# EAGLE design VistelV3 (EAGLE 6.4)

## Sheet 1 of 5
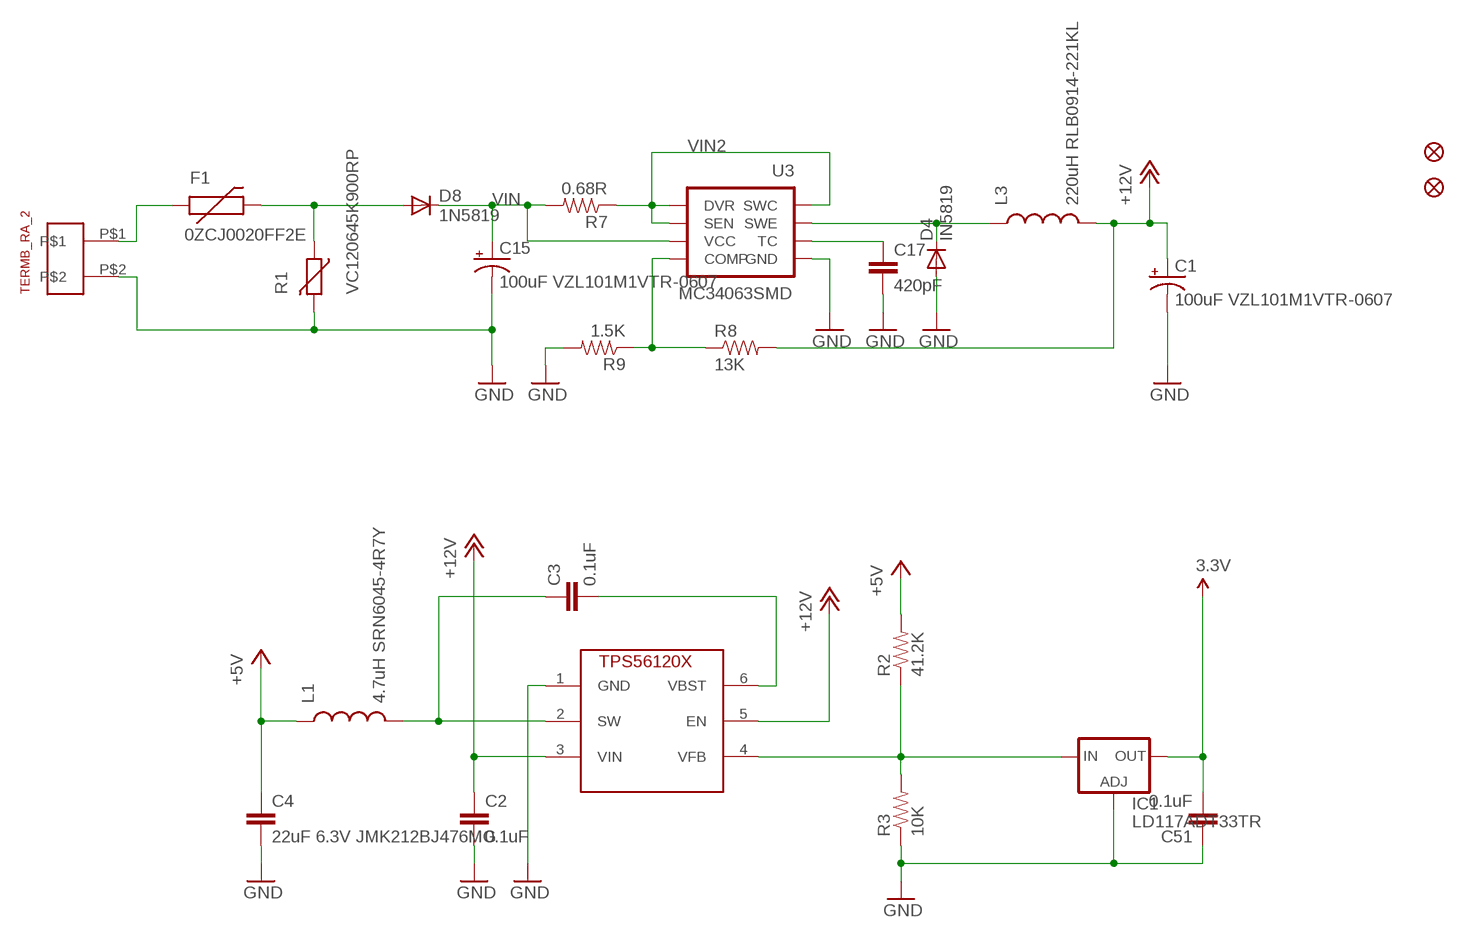
[diagram p0: schematic, sheet 1]

### Parts
C1  100uF VZL101M1VTR-0607  CAP_POLD  [PANASONIC_D]
C2  0.1uF  CAP0805  [0805]
C3  0.1uF  CAP0805  [0805]
C4  22uF 6.3V JMK212BJ476MG  CAP0805  [0805]
C15  100uF VZL101M1VTR-0607  CAP_POLD  [PANASONIC_D]
C17  420pF  CAP0805  [0805]
C51  0.1uF  CAP0805  [0805]
D4  IN5819  DIODESMA  [SMA-DIODE]
D8  1N5819  DIODESMB  [SMB-DIODE]
F1  0ZCJ0020FF2E  PTCSMD  [PTC-1206]
FID1  FIDUCIAL1.5X3  [FIDUCIAL-1.5X3]
FID2  FIDUCIAL1.5X3  [FIDUCIAL-1.5X3]
IC1  LD117ADT33TR  [DPACK]
L1  4.7uH SRN6045-4R7Y  INDUCTOR0805  [0805]
L3  220uH RLB0914-221KL  INDUCTORRADIAL5MM  [RLB914-IND]
R1  VC120645K900RP  VARISTORCN1206  [CT/CN1206]
R2  41.2K  RESISTOR0805-RES  [0805]
R3  10K  RESISTOR0805-RES  [0805]
R7  0.68R  RESISTOR0805-RES  [0805]
R8  13K  RESISTOR0805-RES  [0805]
R9  1.5K  RESISTOR0805-RES  [0805]
U3  MC34063SMD  [SO08]
U$2  1X02_TERMB_RA  [1X02_TERMB_RA]
U$18  TPS56120X  [TSOT23-6_DDC]

### Nets
3.3V: C51.2 IC1.4(OUT) ; also sheet 2,3,4,5
+5V: C4.1 L1.1 R2.2
+12V: C1.+ C2.1 L3.P$2 R8.2 U$18.3(VIN) U$18.5(EN) ; also sheet 3
GND: C1.- C2.2 C4.2 C15.- C17.2 C51.1 D4.A IC1.1(ADJ) R1.2 R3.1 R9.2 U3.4(GND) U$2.P$2 U$18.1(GND) ; also sheet 2,3,4,5
N$4: F1.1 U$2.P$1
N$5: D8.A F1.2 R1.1
N$6: C3.1 L1.2 U$18.2(SW)
N$19: C3.2 U$18.6(VBST)
N$20: IC1.3(IN) R2.1 R3.2 U$18.4(VFB)
N$22: C17.1 U3.3(TC)
N$24: D4.C L3.P$1 U3.2(SWE)
N$25: R8.1 R9.1 U3.5(COMP)
VIN: C15.+ D8.C R7.2 U3.6(VCC)
VIN2: R7.1 U3.1(SWC) U3.7(SEN) U3.8(DVR)

## Sheet 2 of 5
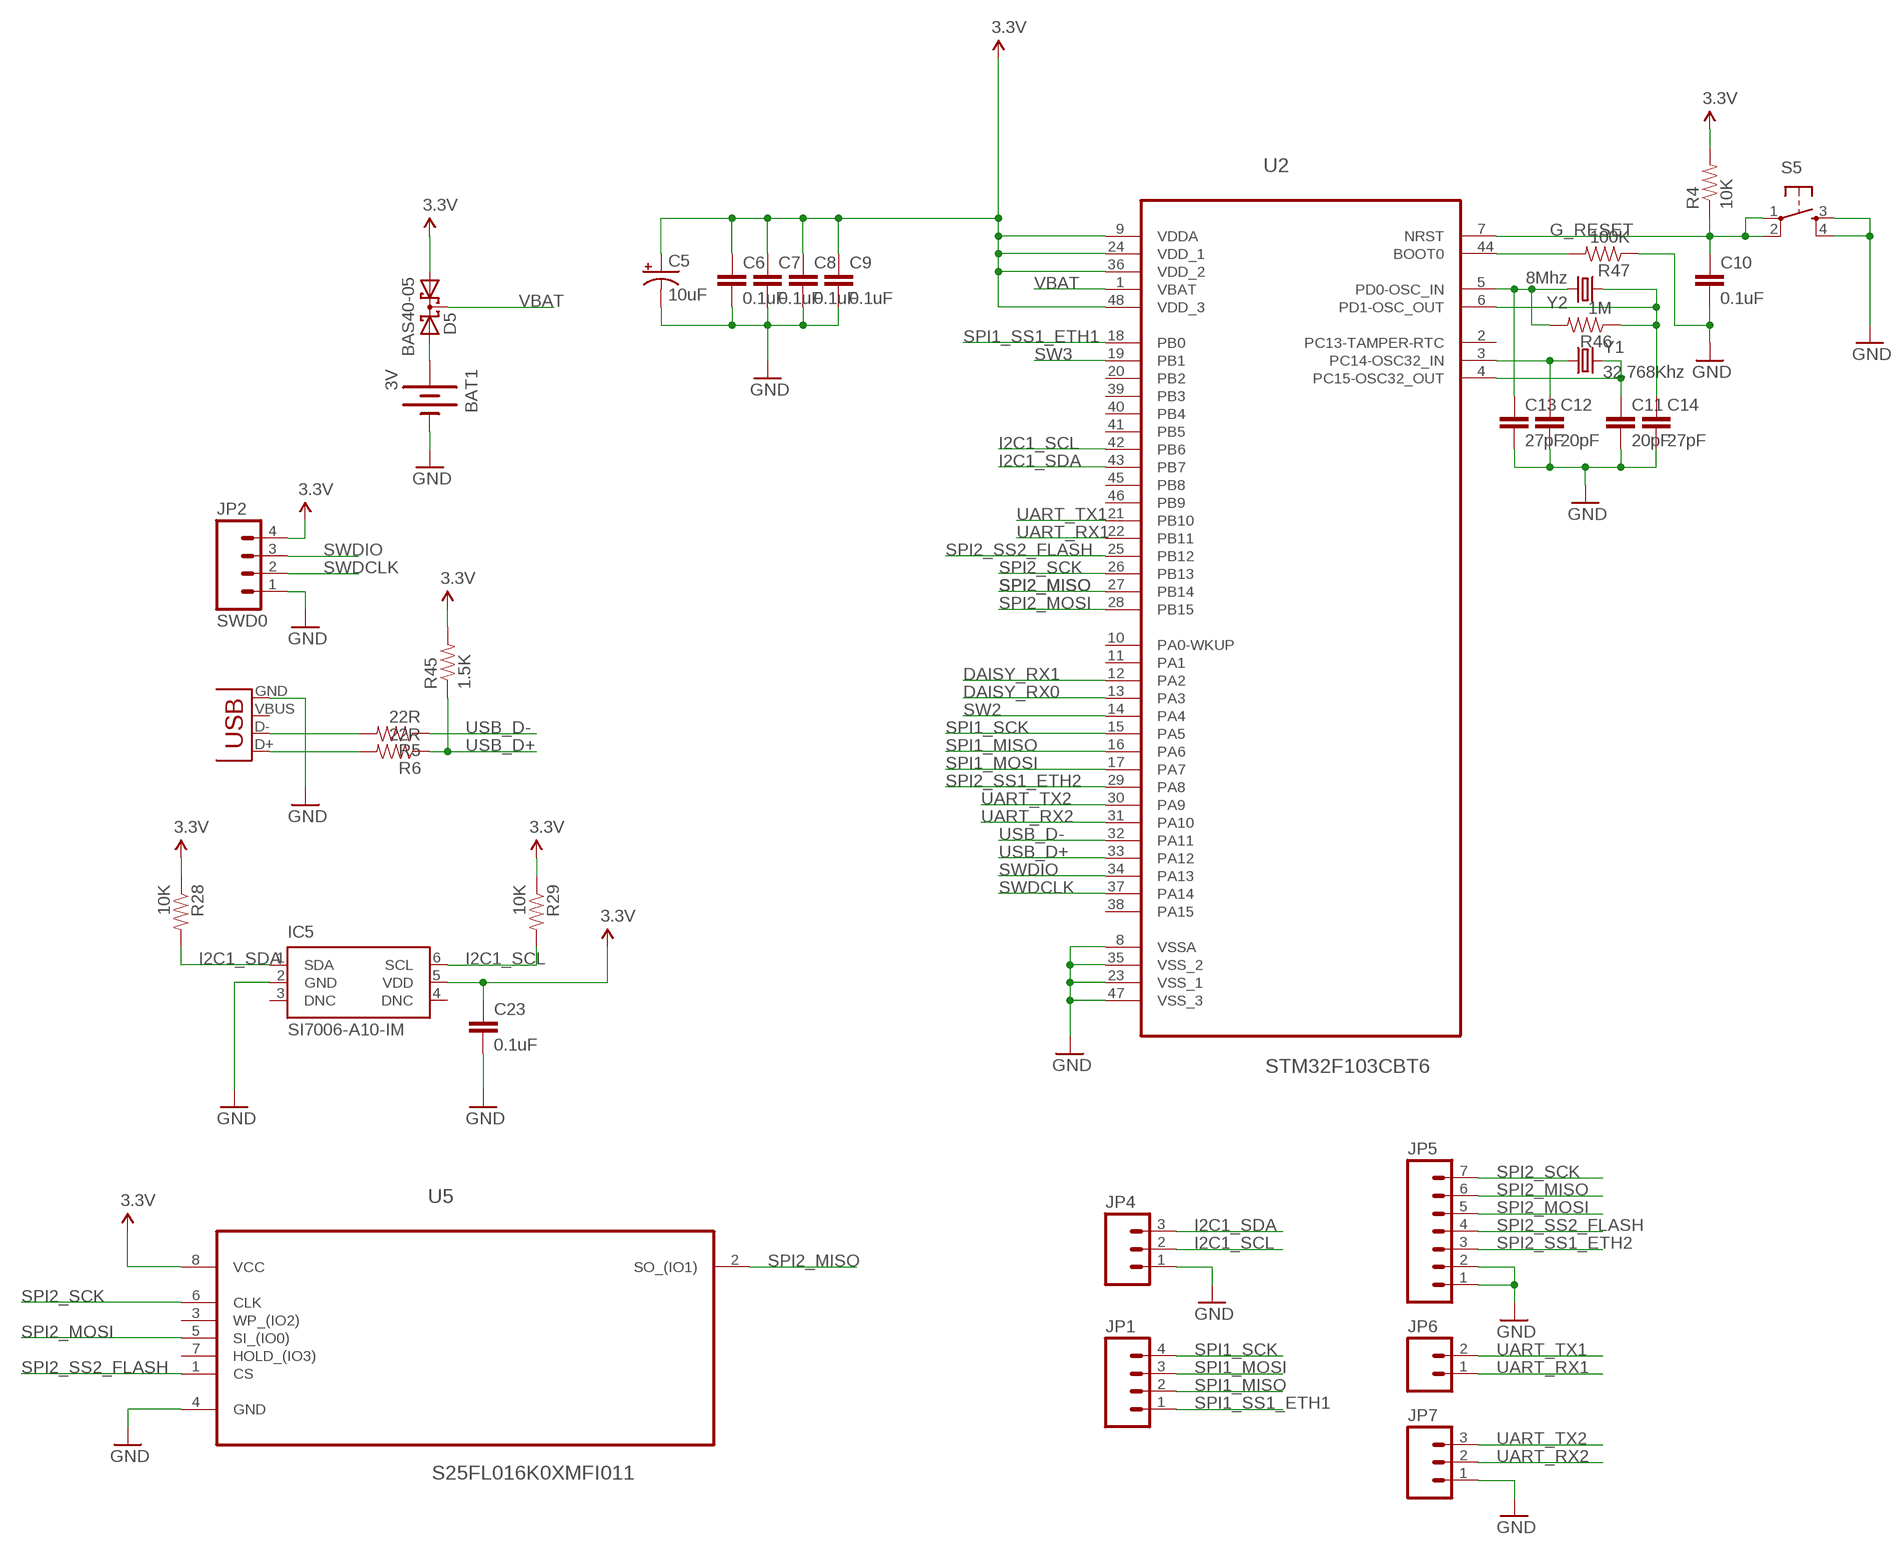
[diagram p1: schematic, sheet 2]

### Parts
BAT1  3V  BATTERY20PTH  [BATTCOM_20MM_PTH]
C5  10uF  10UF-TANT  [EIA3216]
C6  0.1uF  CAP0805  [0805]
C7  0.1uF  CAP0805  [0805]
C8  0.1uF  CAP0805  [0805]
C9  0.1uF  CAP0805  [0805]
C10  0.1uF  CAP0805  [0805]
C11  20pF  CAP0805  [0805]
C12  20pF  CAP0805  [0805]
C13  27pF  CAP0805  [0805]
C14  27pF  CAP0805  [0805]
C23  0.1uF  CAP0805  [0805]
D5  BAS40-05  [SOT23]
IC5  SI7006-A10-IM  [DFN6-3X3]
JP1  M04PTH  [1X04]
JP2  SWD0  M04PTH  [1X04]
JP3  USB-B  USBPTH  [USB-B-PTH]
JP4  M03PTH  [1X03]
JP5  M07  [1X07]
JP6  M02PTH  [1X02]
JP7  M03PTH  [1X03]
R4  10K  RESISTOR0805-RES  [0805]
R5  22R  RESISTOR0805-RES  [0805]
R6  22R  RESISTOR0805-RES  [0805]
R28  10K  RESISTOR0805-RES  [0805]
R29  10K  RESISTOR0805-RES  [0805]
R45  1.5K  RESISTOR0805-RES  [0805]
R46  1M  RESISTOR0805-RES  [0805]
R47  100K  RESISTOR0805-RES  [0805]
S5  TAC_SWITCHPTH  [TACTILE-PTH]
U2  STM32F103CBT6  [QFP50P900X900X160-48N]
U5  S25FL016K0XMFI011  [SOIC127P800X215-8N]
Y1  32.768Khz  MC-306  [MC-306]
Y2  8Mhz  CRYSTALHC49US  [HC49US]

### Nets
3.3V: C5.A(+) C6.1 C7.1 C8.1 C9.1 C23.1 D5.1(A1) IC5.5(VDD) JP2.4 R4.2 R28.1 R29.1 R45.2 U2.9(VDDA) U2.24(VDD_1) U2.36(VDD_2) U2.48(VDD_3) U5.8(VCC) ; also sheet 1,3,4,5
BOOT0: R47.2 U2.44(BOOT0)
DAISY_RX0: U2.13(PA3) ; also sheet 3
DAISY_RX1: U2.12(PA2) ; also sheet 3
G_RESET: C10.1 R4.1 S5.1 S5.2 U2.7(NRST) ; also sheet 3
GND: BAT1.2(-) C5.C(-) C6.2 C7.2 C8.2 C9.2 C10.2 C11.2 C12.2 C13.2 C14.2 C23.2 IC5.2(GND) JP2.1 JP3.GND JP4.1 JP5.1 JP5.2 JP7.1 R47.1 S5.3 S5.4 U2.8(VSSA) U2.23(VSS_1) U2.35(VSS_2) U2.47(VSS_3) U5.4(GND) ; also sheet 1,3,4,5
I2C1_SCL: IC5.6(SCL) JP4.2 R29.2 U2.42(PB6)
I2C1_SDA: IC5.1(SDA) JP4.3 R28.2 U2.43(PB7)
N$3: BAT1.1(+) D5.2(A2)
N$7: C14.1 R46.1 U2.6(PD1-OSC_OUT) Y2.1
N$10: JP3.D- R5.2
N$11: JP3.D+ R6.2
N$14: C12.1 U2.3(PC14-OSC32_IN) Y1.1
N$15: C11.1 U2.4(PC15-OSC32_OUT) Y1.4
N$16: C13.1 R46.2 U2.5(PD0-OSC_IN) Y2.2
SPI1_MISO: JP1.2 U2.16(PA6) ; also sheet 4
SPI1_MOSI: JP1.3 U2.17(PA7) ; also sheet 4
SPI1_SCK: JP1.4 U2.15(PA5) ; also sheet 4
SPI1_SS1_ETH1: JP1.1 U2.18(PB0) ; also sheet 4
SPI2_MISO: JP5.6 U2.27(PB14) U5.2(SO_(IO1)) ; also sheet 4
SPI2_MOSI: JP5.5 U2.28(PB15) U5.5(SI_(IO0)) ; also sheet 4
SPI2_SCK: JP5.7 U2.26(PB13) U5.6(CLK) ; also sheet 4
SPI2_SS1_ETH2: JP5.3 U2.29(PA8) ; also sheet 4
SPI2_SS2_FLASH: JP5.4 U2.25(PB12) U5.1(CS)
SW2: U2.14(PA4) ; also sheet 3
SW3: U2.19(PB1) ; also sheet 3
SWDCLK: JP2.2 U2.37(PA14)
SWDIO: JP2.3 U2.34(PA13)
UART_RX1: JP6.1 U2.22(PB11)
UART_RX2: JP7.2 U2.31(PA10) ; also sheet 5
UART_TX1: JP6.2 U2.21(PB10)
UART_TX2: JP7.3 U2.30(PA9) ; also sheet 5
USB_D+: R6.1 R45.1 U2.33(PA12)
USB_D-: R5.1 U2.32(PA11)
VBAT: D5.3(C) U2.1(VBAT)
Unconnected: IC5.3(DNC) IC5.4(DNC) JP3.VBUS U2.2(PC13-TAMPER-RTC) U2.10(PA0-WKUP) U2.11(PA1) U2.20(PB2) U2.38(PA15) U2.39(PB3) U2.40(PB4) U2.41(PB5) U2.45(PB8) U2.46(PB9) U5.3(WP_(IO2)) U5.7(HOLD_(IO3))

## Sheet 3 of 5
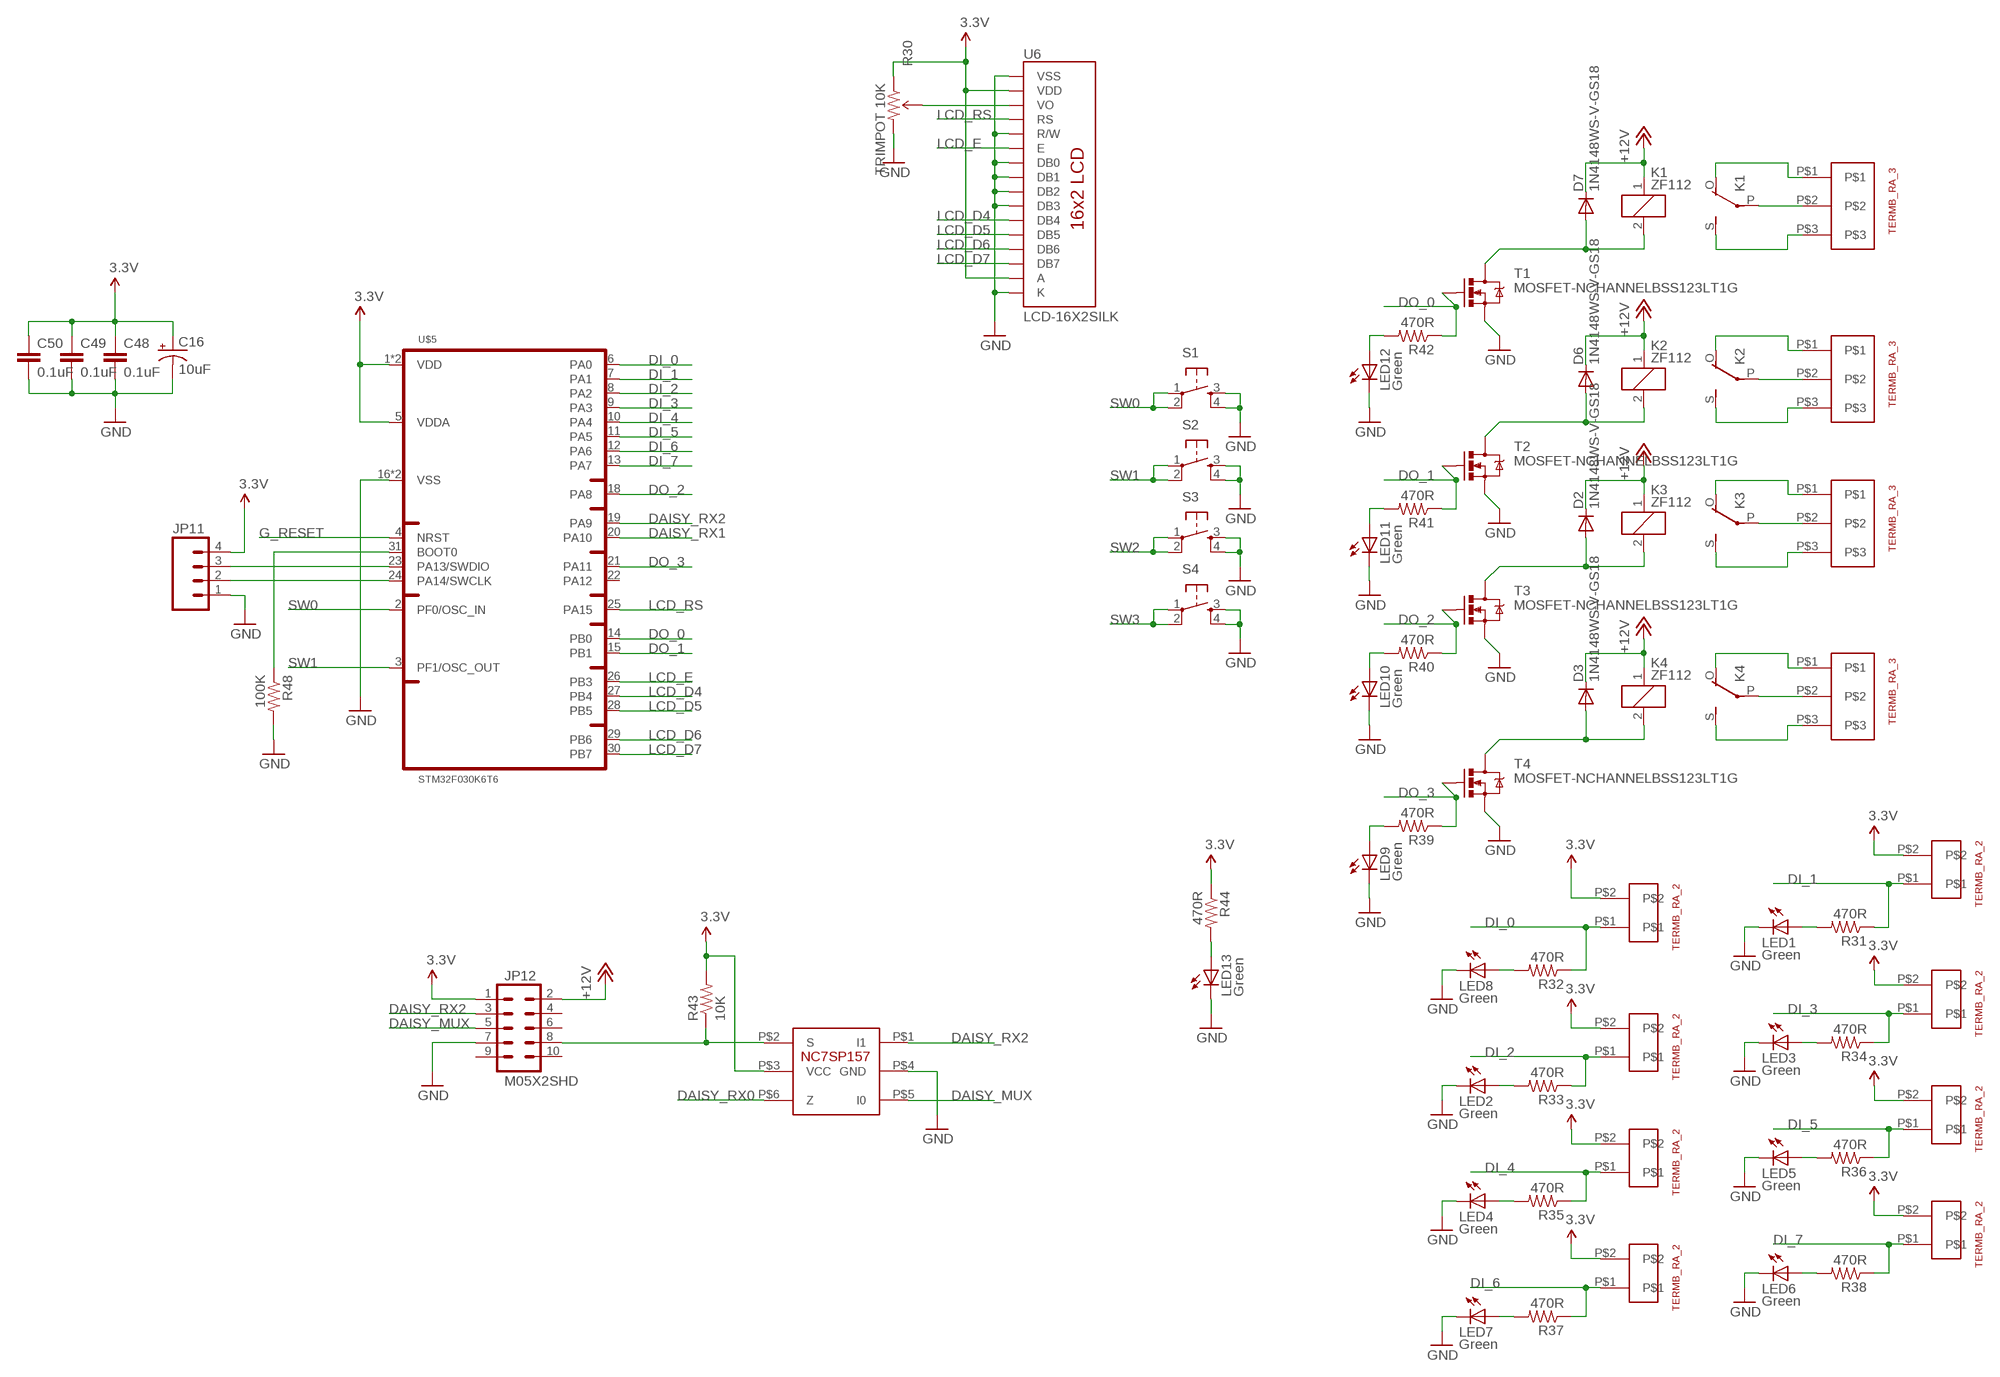
[diagram p2: schematic, sheet 3]

### Parts
C16  10uF  10UF-TANT  [EIA3216]
C48  0.1uF  CAP0805  [0805]
C49  0.1uF  CAP0805  [0805]
C50  0.1uF  CAP0805  [0805]
D2  1N4148WS-V-GS18  DIODESMA-ALT  [SMA-DIODE_ALT]
D3  1N4148WS-V-GS18  DIODESMA-ALT  [SMA-DIODE_ALT]
D6  1N4148WS-V-GS18  DIODESMA-ALT  [SMA-DIODE_ALT]
D7  1N4148WS-V-GS18  DIODESMA-ALT  [SMA-DIODE_ALT]
JP11  M04PTH  [1X04]
JP12  M05X2SHD  [2X5-SHROUDED]
K1  ZF112  [ZF112]
K2  ZF112  [ZF112]
K3  ZF112  [ZF112]
K4  ZF112  [ZF112]
LED1  Green  LED1206  [LED-1206]
LED2  Green  LED1206  [LED-1206]
LED3  Green  LED1206  [LED-1206]
LED4  Green  LED1206  [LED-1206]
LED5  Green  LED1206  [LED-1206]
LED6  Green  LED1206  [LED-1206]
LED7  Green  LED1206  [LED-1206]
LED8  Green  LED1206  [LED-1206]
LED9  Green  LED1206  [LED-1206]
LED10  Green  LED1206  [LED-1206]
LED11  Green  LED1206  [LED-1206]
LED12  Green  LED1206  [LED-1206]
LED13  Green  LED1206  [LED-1206]
R30  TRIMPOT 10K  TRIMPOTPTH  [TRIM_POT_PTH]
R31  470R  RESISTOR0805-RES  [0805]
R32  470R  RESISTOR0805-RES  [0805]
R33  470R  RESISTOR0805-RES  [0805]
R34  470R  RESISTOR0805-RES  [0805]
R35  470R  RESISTOR0805-RES  [0805]
R36  470R  RESISTOR0805-RES  [0805]
R37  470R  RESISTOR0805-RES  [0805]
R38  470R  RESISTOR0805-RES  [0805]
R39  470R  RESISTOR0805-RES  [0805]
R40  470R  RESISTOR0805-RES  [0805]
R41  470R  RESISTOR0805-RES  [0805]
R42  470R  RESISTOR0805-RES  [0805]
R43  10K  RESISTOR0805-RES  [0805]
R44  470R  RESISTOR0805-RES  [0805]
R48  100K  RESISTOR0805-RES  [0805]
S1  TAC_SWITCHPTH  [TACTILE-PTH]
S2  TAC_SWITCHPTH  [TACTILE-PTH]
S3  TAC_SWITCHPTH  [TACTILE-PTH]
S4  TAC_SWITCHPTH  [TACTILE-PTH]
T1  MOSFET-NCHANNELBSS123LT1G  [SOT23]
T2  MOSFET-NCHANNELBSS123LT1G  [SOT23]
T3  MOSFET-NCHANNELBSS123LT1G  [SOT23]
T4  MOSFET-NCHANNELBSS123LT1G  [SOT23]
U6  LCD-16X2SILK  [LCD-16X2]
U$4  NC7SP157  [SC70-6]
U$5  STM32F030K6T6  [LQFP32-7X7]
U$6  1X02_TERMB_RA  [1X02_TERMB_RA]
U$7  1X02_TERMB_RA  [1X02_TERMB_RA]
U$8  1X02_TERMB_RA  [1X02_TERMB_RA]
U$9  1X02_TERMB_RA  [1X02_TERMB_RA]
U$10  1X02_TERMB_RA  [1X02_TERMB_RA]
U$11  1X02_TERMB_RA  [1X02_TERMB_RA]
U$12  1X02_TERMB_RA  [1X02_TERMB_RA]
U$13  1X02_TERMB_RA  [1X02_TERMB_RA]
U$14  1X03_TERMB_RA  [1X03_TERMB_RA]
U$15  1X03_TERMB_RA  [1X03_TERMB_RA]
U$16  1X03_TERMB_RA  [1X03_TERMB_RA]
U$17  1X03_TERMB_RA  [1X03_TERMB_RA]

### Nets
3.3V: C16.A(+) C48.1 C49.1 C50.1 JP11.4 JP12.1 R30.1(CCW) R43.2 R44.1 U6.2(VDD) U6.15(A) U$4.P$3(VCC) U$5.1(VDD) U$5.5(VDDA) U$5.17(VDD) U$6.P$2 U$7.P$2 U$8.P$2 U$9.P$2 U$10.P$2 U$11.P$2 U$12.P$2 U$13.P$2 ; also sheet 1,2,4,5
+12V: D2.C D3.C D6.C D7.C JP12.2 K1.1 K2.1 K3.1 K4.1 ; also sheet 1
DAISY_MUX: JP12.5 U$4.P$5(I0)
DAISY_RX0: U$4.P$6(Z) ; also sheet 2
DAISY_RX1: U$5.20(PA10) ; also sheet 2
DAISY_RX2: JP12.3 U$4.P$1(I1) U$5.19(PA9)
DI_0: R32.1 U$5.6(PA0) U$6.P$1
DI_1: R31.1 U$5.7(PA1) U$7.P$1
DI_2: R33.1 U$5.8(PA2) U$13.P$1
DI_3: R34.1 U$5.9(PA3) U$8.P$1
DI_4: R35.1 U$5.10(PA4) U$12.P$1
DI_5: R36.1 U$5.11(PA5) U$9.P$1
DI_6: R37.1 U$5.12(PA6) U$11.P$1
DI_7: R38.1 U$5.13(PA7) U$10.P$1
DO_0: R42.1 T1.1(G) U$5.14(PB0)
DO_1: R41.1 T2.1(G) U$5.15(PB1)
DO_2: R40.1 T3.1(G) U$5.18(PA8)
DO_3: R39.1 T4.1(G) U$5.21(PA11)
G_RESET: U$5.4(NRST) ; also sheet 2
GND: C16.C(-) C48.2 C49.2 C50.2 JP11.1 JP12.7 LED1.C LED2.C LED3.C LED4.C LED5.C LED6.C LED7.C LED8.C LED9.C LED10.C LED11.C LED12.C LED13.C R30.3(CW) R48.2 S1.3 S1.4 S2.3 S2.4 S3.3 S3.4 S4.3 S4.4 T1.2(S) T2.2(S) T3.2(S) T4.2(S) U6.1(VSS) U6.5(R/W) U6.7(DB0) U6.8(DB1) U6.9(DB2) U6.10(DB3) U6.16(K) U$4.P$4(GND) U$5.16(VSS) U$5.32(VSS) ; also sheet 1,2,4,5
LCD_D4: U6.11(DB4) U$5.27(PB4)
LCD_D5: U6.12(DB5) U$5.28(PB5)
LCD_D6: U6.13(DB6) U$5.29(PB6)
LCD_D7: U6.14(DB7) U$5.30(PB7)
LCD_E: U6.6(E) U$5.26(PB3)
LCD_RS: U6.4(RS) U$5.25(PA15)
N$1: K1.P(2:P) U$14.P$2
N$8: LED13.A R44.2
N$9: LED7.A R37.2
N$12: R30.2(WIPER) U6.3(VO)
N$13: K4.O(2:O) U$17.P$1
N$17: R48.1 U$5.31(BOOT0)
N$21: K4.S(2:S) U$17.P$3
N$53: K3.S(2:S) U$16.P$3
N$54: K2.P(2:P) U$15.P$2
N$55: K3.O(2:O) U$16.P$1
N$56: K2.O(2:O) U$15.P$1
N$57: K2.S(2:S) U$15.P$3
N$58: K3.P(2:P) U$16.P$2
N$59: K1.O(2:O) U$14.P$1
N$60: K4.P(2:P) U$17.P$2
N$61: K1.S(2:S) U$14.P$3
N$62: D7.A K1.2 T1.3(D)
N$63: D6.A K2.2 T2.3(D)
N$64: D2.A K3.2 T3.3(D)
N$65: D3.A K4.2 T4.3(D)
N$66: LED12.A R42.2
N$67: LED11.A R41.2
N$69: JP11.3 U$5.23(PA13/SWDIO)
N$70: LED10.A R40.2
N$71: JP11.2 U$5.24(PA14/SWCLK)
N$72: LED9.A R39.2
N$73: LED1.A R31.2
N$74: LED8.A R32.2
N$75: LED2.A R33.2
N$77: JP12.8 R43.1 U$4.P$2(S)
N$78: LED3.A R34.2
N$80: LED5.A R36.2
N$82: LED4.A R35.2
N$87: LED6.A R38.2
SW0: S1.1 S1.2 U$5.2(PF0/OSC_IN)
SW1: S2.1 S2.2 U$5.3(PF1/OSC_OUT)
SW2: S3.1 S3.2 ; also sheet 2
SW3: S4.1 S4.2 ; also sheet 2
Unconnected: JP12.4 JP12.6 JP12.9 JP12.10 U$5.22(PA12)

## Sheet 4 of 5
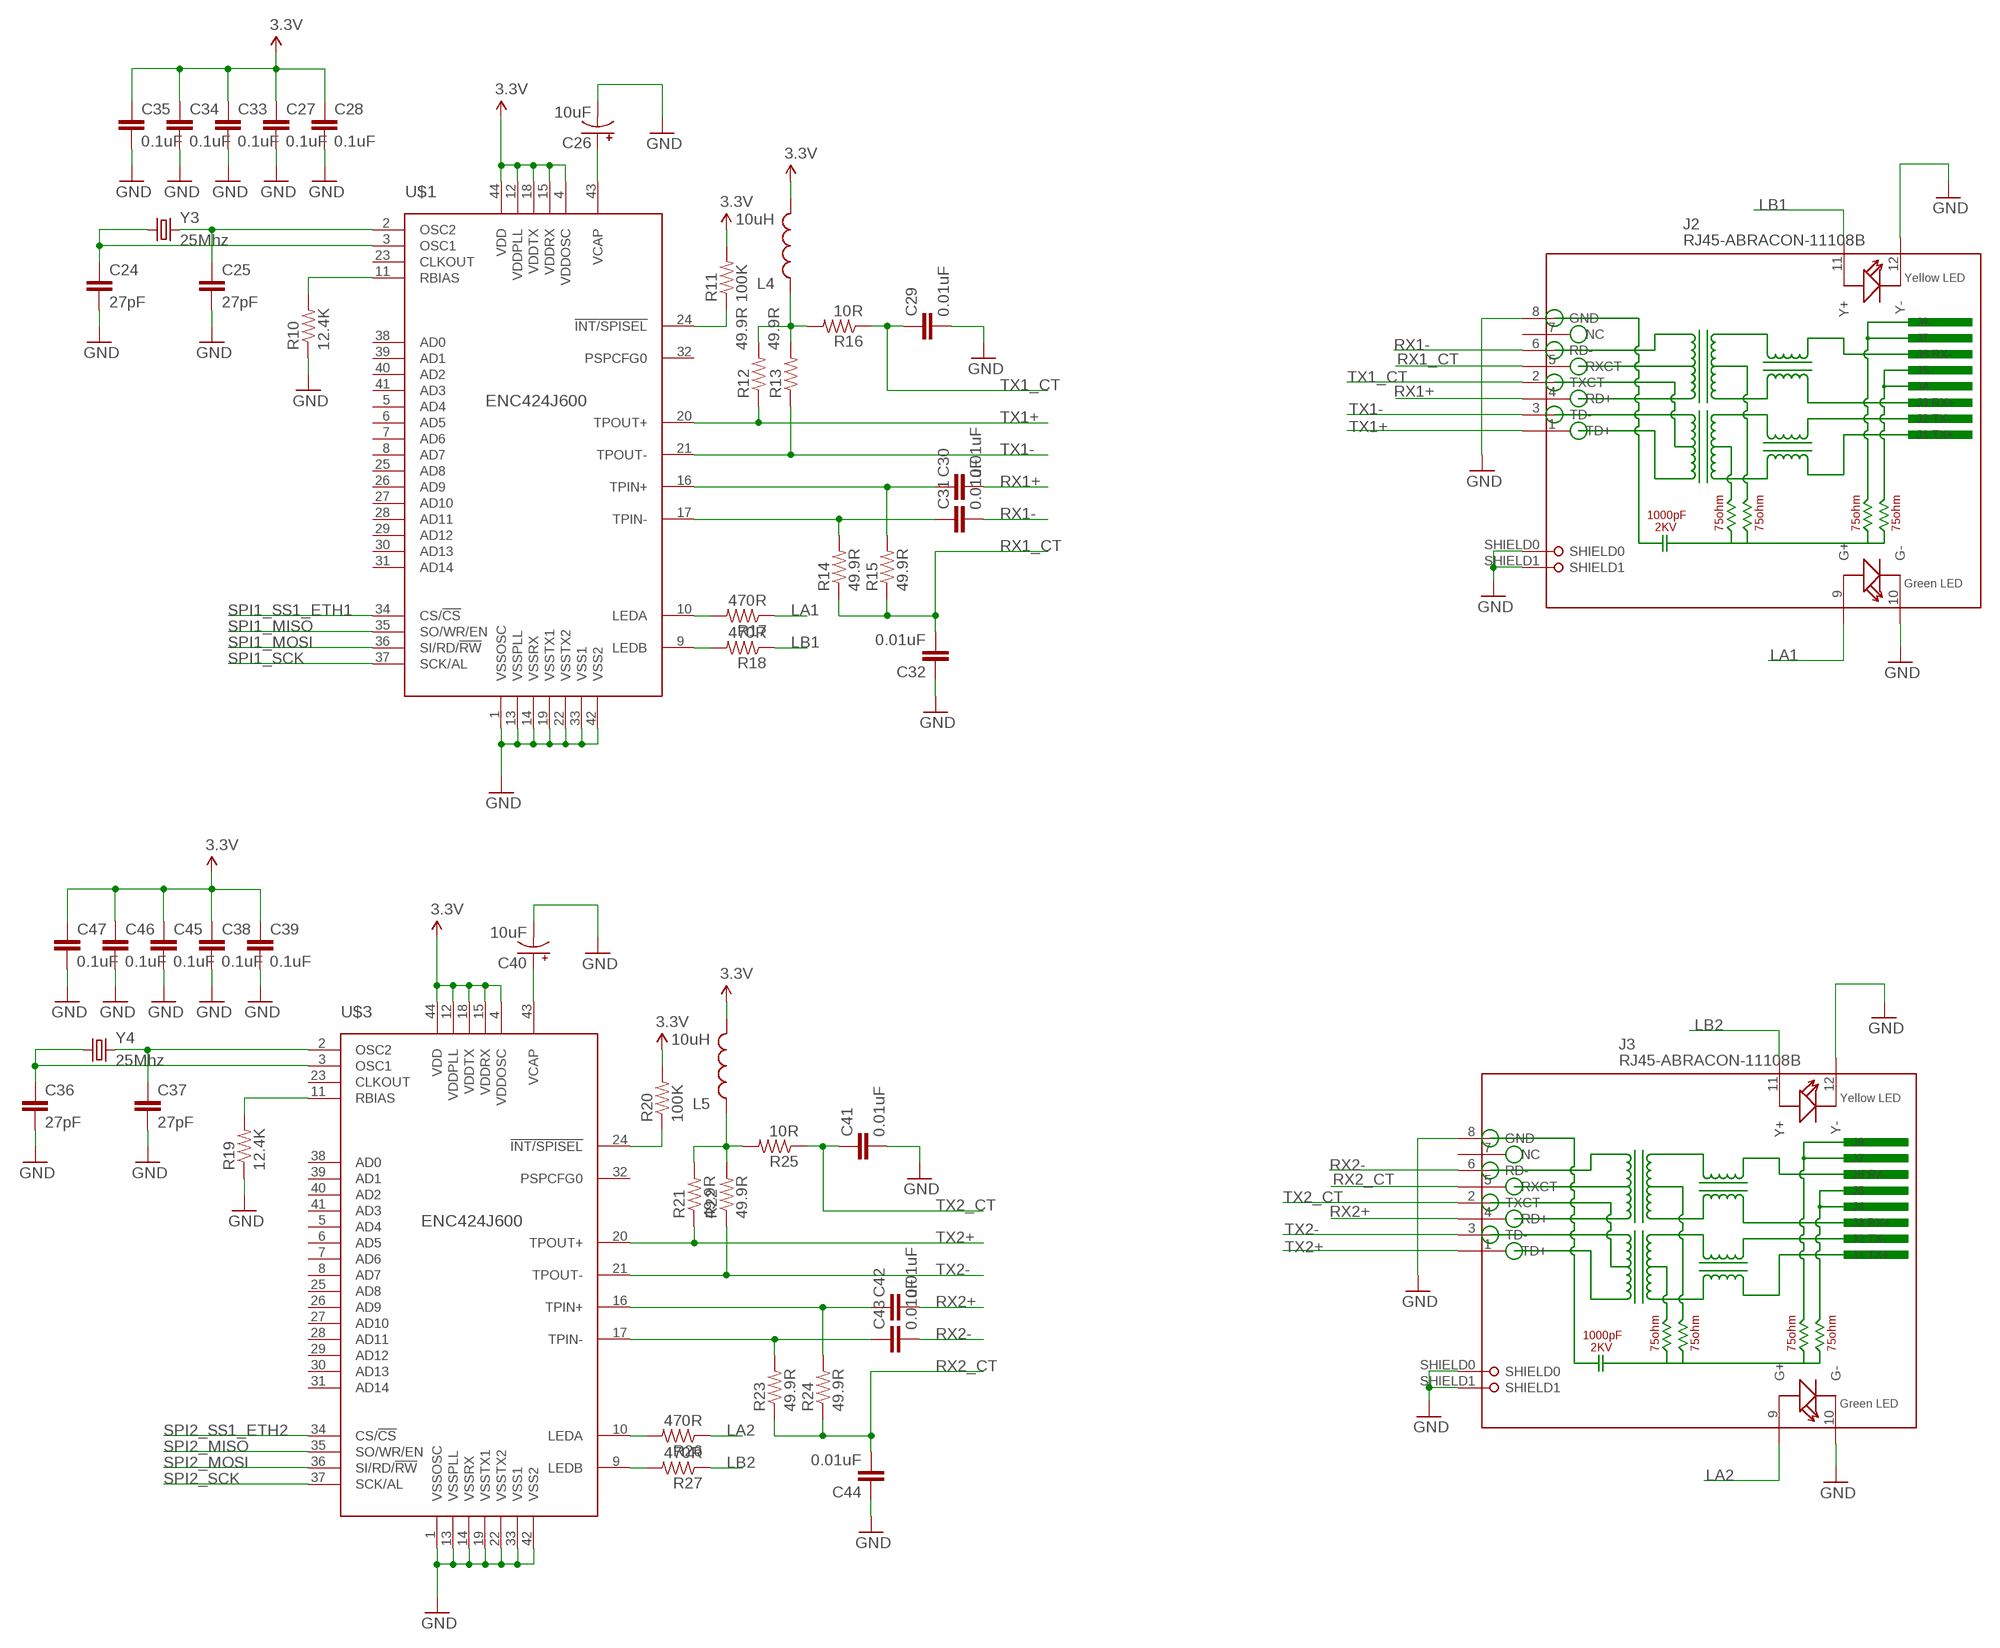
[diagram p3: schematic, sheet 4]

### Parts
C24  27pF  CAP0805  [0805]
C25  27pF  CAP0805  [0805]
C26  10uF  CAP_POL3528-KIT  [EIA3528-KIT]
C27  0.1uF  CAP0805  [0805]
C28  0.1uF  CAP0805  [0805]
C29  0.01uF  CAP0805  [0805]
C30  0.01uF  CAP0805  [0805]
C31  0.01uF  CAP0805  [0805]
C32  0.01uF  CAP0805  [0805]
C33  0.1uF  CAP0805  [0805]
C34  0.1uF  CAP0805  [0805]
C35  0.1uF  CAP0805  [0805]
C36  27pF  CAP0805  [0805]
C37  27pF  CAP0805  [0805]
C38  0.1uF  CAP0805  [0805]
C39  0.1uF  CAP0805  [0805]
C40  10uF  CAP_POL3528-KIT  [EIA3528-KIT]
C41  0.01uF  CAP0805  [0805]
C42  0.01uF  CAP0805  [0805]
C43  0.01uF  CAP0805  [0805]
C44  0.01uF  CAP0805  [0805]
C45  0.1uF  CAP0805  [0805]
C46  0.1uF  CAP0805  [0805]
C47  0.1uF  CAP0805  [0805]
J2  RJ45-ABRACON-11108B  [RJ45-ABRACON-111008B]
J3  RJ45-ABRACON-11108B  [RJ45-ABRACON-111008B]
L4  10uH  INDUCTOR0805  [0805]
L5  10uH  INDUCTOR0805  [0805]
R10  12.4K  RESISTOR0805-RES  [0805]
R11  100K  RESISTOR0805-RES  [0805]
R12  49.9R  RESISTOR0805-RES  [0805]
R13  49.9R  RESISTOR0805-RES  [0805]
R14  49.9R  RESISTOR0805-RES  [0805]
R15  49.9R  RESISTOR0805-RES  [0805]
R16  10R  RESISTOR0805-RES  [0805]
R17  470R  RESISTOR0805-RES  [0805]
R18  470R  RESISTOR0805-RES  [0805]
R19  12.4K  RESISTOR0805-RES  [0805]
R20  100K  RESISTOR0805-RES  [0805]
R21  49.9R  RESISTOR0805-RES  [0805]
R22  49.9R  RESISTOR0805-RES  [0805]
R23  49.9R  RESISTOR0805-RES  [0805]
R24  49.9R  RESISTOR0805-RES  [0805]
R25  10R  RESISTOR0805-RES  [0805]
R26  470R  RESISTOR0805-RES  [0805]
R27  470R  RESISTOR0805-RES  [0805]
U$1  ENC424J600  [TQFP-44]
U$3  ENC424J600  [TQFP-44]
Y3  25Mhz  CRYSTAL10.5X4.8  [CRYSTAL-SMD-10.5X4.8-2PIN]
Y4  25Mhz  CRYSTAL10.5X4.8  [CRYSTAL-SMD-10.5X4.8-2PIN]

### Nets
3.3V: C27.1 C28.1 C33.1 C34.1 C35.1 C38.1 C39.1 C45.1 C46.1 C47.1 L4.2 L5.2 R11.2 R20.2 U$1.4(VDDOSC) U$1.12(VDDPLL) U$1.15(VDDRX) U$1.18(VDDTX) U$1.44(VDD) U$3.4(VDDOSC) U$3.12(VDDPLL) U$3.15(VDDRX) U$3.18(VDDTX) U$3.44(VDD) ; also sheet 1,2,3,5
GND: C24.2 C25.2 C26.C(-) C27.2 C28.2 C29.2 C32.1 C33.2 C34.2 C35.2 C36.2 C37.2 C38.2 C39.2 C40.C(-) C41.2 C44.1 C45.2 C46.2 C47.2 J2.8(GND) J2.10(G-) J2.12(Y-) J2.SHIELD0 J2.SHIELD1 J3.8(GND) J3.10(G-) J3.12(Y-) J3.SHIELD0 J3.SHIELD1 R10.1 R19.1 U$1.1(VSSOSC) U$1.13(VSSPLL) U$1.14(VSSRX) U$1.19(VSSTX1) U$1.22(VSSTX2) U$1.33(VSS1) U$1.42(VSS2) U$3.1(VSSOSC) U$3.13(VSSPLL) U$3.14(VSSRX) U$3.19(VSSTX1) U$3.22(VSSTX2) U$3.33(VSS1) U$3.42(VSS2) ; also sheet 1,2,3,5
LA1: J2.9(G+) R17.1
LA2: J3.9(G+) R26.1
LB1: J2.11(Y+) R18.1
LB2: J3.11(Y+) R27.1
N$33: C24.1 U$1.3(OSC1) Y3.P$1
N$34: C40.A(+) U$3.43(VCAP)
N$35: C37.1 U$3.2(OSC2) Y4.P$2
N$36: C30.1 R15.2 U$1.16(TPIN+)
N$37: C26.A(+) U$1.43(VCAP)
N$38: C31.1 R14.2 U$1.17(TPIN-)
N$39: R19.2 U$3.11(RBIAS)
N$40: C25.1 U$1.2(OSC2) Y3.P$2
N$41: R10.2 U$1.11(RBIAS)
N$42: R11.1 U$1.24(!INT/SPISEL)
N$43: R17.2 U$1.10(LEDA)
N$44: R18.2 U$1.9(LEDB)
N$45: L4.1 R12.2 R13.2 R16.2
N$46: R20.1 U$3.24(!INT/SPISEL)
N$47: C36.1 U$3.3(OSC1) Y4.P$1
N$48: C42.1 R24.2 U$3.16(TPIN+)
N$49: C43.1 R23.2 U$3.17(TPIN-)
N$50: L5.1 R21.2 R22.2 R25.2
N$51: R26.2 U$3.10(LEDA)
N$52: R27.2 U$3.9(LEDB)
RX1+: C30.2 J2.4(RD+)
RX1-: C31.2 J2.6(RD-)
RX1_CT: C32.2 J2.5(RXCT) R14.1 R15.1
RX2+: C42.2 J3.4(RD+)
RX2-: C43.2 J3.6(RD-)
RX2_CT: C44.2 J3.5(RXCT) R23.1 R24.1
SPI1_MISO: U$1.35(SO/WR/EN) ; also sheet 2
SPI1_MOSI: U$1.36(SI/RD/!RW) ; also sheet 2
SPI1_SCK: U$1.37(SCK/AL) ; also sheet 2
SPI1_SS1_ETH1: U$1.34(CS/!CS) ; also sheet 2
SPI2_MISO: U$3.35(SO/WR/EN) ; also sheet 2
SPI2_MOSI: U$3.36(SI/RD/!RW) ; also sheet 2
SPI2_SCK: U$3.37(SCK/AL) ; also sheet 2
SPI2_SS1_ETH2: U$3.34(CS/!CS) ; also sheet 2
TX1+: J2.1(TD+) R12.1 U$1.20(TPOUT+)
TX1-: J2.3(TD-) R13.1 U$1.21(TPOUT-)
TX1_CT: C29.1 J2.2(TXCT) R16.1
TX2+: J3.1(TD+) R21.1 U$3.20(TPOUT+)
TX2-: J3.3(TD-) R22.1 U$3.21(TPOUT-)
TX2_CT: C41.1 J3.2(TXCT) R25.1
Unconnected: J2.7(NC) J3.7(NC) U$1.5(AD4) U$1.6(AD5) U$1.7(AD6) U$1.8(AD7) U$1.23(CLKOUT) U$1.25(AD8) U$1.26(AD9) U$1.27(AD10) U$1.28(AD11) U$1.29(AD12) U$1.30(AD13) U$1.31(AD14) U$1.32(PSPCFG0) U$1.38(AD0) U$1.39(AD1) U$1.40(AD2) U$1.41(AD3) U$3.5(AD4) U$3.6(AD5) U$3.7(AD6) U$3.8(AD7) U$3.23(CLKOUT) U$3.25(AD8) U$3.26(AD9) U$3.27(AD10) U$3.28(AD11) U$3.29(AD12) U$3.30(AD13) U$3.31(AD14) U$3.32(PSPCFG0) U$3.38(AD0) U$3.39(AD1) U$3.40(AD2) U$3.41(AD3)

## Sheet 5 of 5
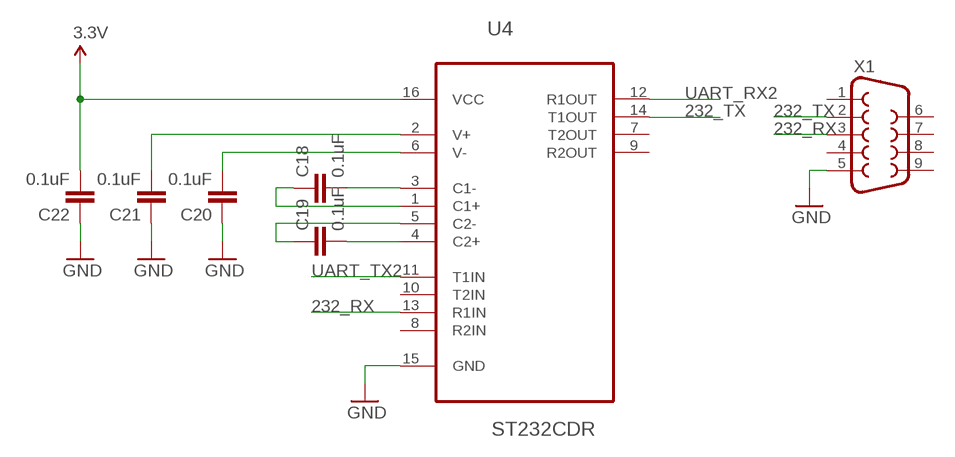
[diagram p4: schematic, sheet 5]

### Parts
C18  0.1uF  CAP0805  [0805]
C19  0.1uF  CAP0805  [0805]
C20  0.1uF  CAP0805  [0805]
C21  0.1uF  CAP0805  [0805]
C22  0.1uF  CAP0805  [0805]
U4  ST232CDR  [SOIC127P600X175-16N]
X1  DB9FEMALE  [DB9]

### Nets
3.3V: C22.2 U4.16(VCC) ; also sheet 1,2,3,4
232_RX: U4.13(R1IN) X1.3
232_TX: U4.14(T1OUT) X1.2
GND: C20.1 C21.1 C22.1 U4.15(GND) X1.5 ; also sheet 1,2,3,4
N$26: C21.2 U4.2(V+)
N$27: C20.2 U4.6(V-)
N$28: C18.2 U4.3(C1-)
N$29: C18.1 U4.1(C1+)
N$30: C19.1 U4.5(C2-)
N$31: C19.2 U4.4(C2+)
UART_RX2: U4.12(R1OUT) ; also sheet 2
UART_TX2: U4.11(T1IN) ; also sheet 2
Unconnected: U4.7(T2OUT) U4.8(R2IN) U4.9(R2OUT) U4.10(T2IN) X1.1 X1.4 X1.6 X1.7 X1.8 X1.9

## Library data of the parts
BAT1 = SparkFun-Electromechanical:BATTERY: Battery Holders Various common sizes : AA, AAA, 20mm coin cell and 12mm coin cell. 20MM_4LEGS, BATT-10373
C1 C15 C26 C40 = SparkFun-Capacitors:CAP_POL: Capacitor Polarized These are standard SMD and PTH capacitors. Normally 10uF, 47uF, and 100uF in electrolytic and tantalum varieties. Always verify the external diameter of the through hole cap, it varies with capacity, voltage, and manufacturer. The EIA devices should be standard.
C2-C4 C17-C22 C51 = SparkFun-Passives:CAP: Capacitor Standard 0603 ceramic capacitor, and 0.1" leaded capacitor.
C5 C16 = SparkFun-Capacitors:10UF-TANT: 10uF Tantalum SMT CAP-00811- 16V 10% (EIA-3216); PROD_ID: CAP-00811
C6-C14 C23-C25 C27-C39 C41-C50 = SparkFun-Capacitors:CAP: Capacitor Standard 0603 ceramic capacitor, and 0.1" leaded capacitor.
D2-D4 D6-D8 = SparkFun-DiscreteSemi:DIODE: Diode These are standard reverse protection diodes and small signal diodes. SMA package can handle up to about 1A. SOD-323 can handle about 200mA. What the SOD-323 package when ordering, there are some mfgs out there that are 5-pin packages.
D5 = diode:BAS40-05: Silicon Schottky Diodes General-purpose diode for high-speed switching
F1 = SparkFun-PowerIC:PTC: Resettable Fuse PTC Resettable Fuse. Spark Fun Electronics SKU : COM-08357
FID1 FID2 = SparkFun-Aesthetics:FIDUCIAL: Fiducial Alignment Points Various fiducial points for machine vision alignment.
IC1 = v-reg:LD117A?*: Low drop fixed and adjustable positive voltage regulators 1 A Source: http://www.st.com/stonline/products/literature/ds/7194/ld1117axx.pdf
IC5 = si70xx-10:SI7006-*: I2C Humidity and Temperature Sensor Source: http://www.silabs.com/Support%20Documents/TechnicalDocs/Si7006-A10.pdf; MF: Silicon Labs; MPN: Si7006-A10-IM; OC_FARNELL: unknown; OC_NEWARK: unknown
J2 J3 = Connector:RJ45-ABRACON-11108B
JP1 JP2 JP11 = SparkFun-Connectors:M04: Header 4 Standard 4-pin 0.1" header. Use with straight break away headers (SKU : PRT-00116), right angle break away headers (PRT-00553), swiss pins (PRT-00743), machine pins (PRT-00117), and female headers (PRT-00115). Molex polarized connector foot print use with SKU : PRT-08231 with associated crimp pins and housings. 1MM SMD Version SKU: PRT-10208
JP3 = SparkFun-Connectors:USB: USB Connectors USB-B-PTH is fully proven SKU : PRT-00139/CONN-08278 USB-miniB is fully proven SKU : PRT-00587 USB-A-PCB is untested. USB-A-H is throughly reviewed, but untested. Spark Fun Electronics SKU : PRT-00437 USB-B-SMT is throughly reviewed, but untested. Needs silkscreen touching up. USB-A-S has not been used/tested USB-MB-H has not been used/tested USB-MICROB has been used. CONN-09505; PROD_ID: CONN-08278
JP4 JP7 = SparkFun-Connectors:M03: Header 3 Standard 3-pin 0.1" header. Use with straight break away headers (SKU : PRT-00116), right angle break away headers (PRT-00553), swiss pins (PRT-00743), machine pins (PRT-00117), and female headers (PRT-00115). Molex polarized connector foot print use with SKU : PRT-08232 with associated crimp pins and housings.
JP5 = SparkFun-Connectors:M07: Header 7 Standard 7-pin 0.1" header. Use with straight break away headers (SKU : PRT-00116), right angle break away headers (PRT-00553), swiss pins (PRT-00743), machine pins (PRT-00117), and female headers (PRT-00115). NOTES ON THE VARIANTS LOCK and LOCK_LONGPADS... This footprint was designed to help hold the alignment of a through-hole component (i.e. 7-pin header) while soldering it into place. You may notice that each hole has been shifted either up or down by 0.005 of an inch from it's more standard position (which is usually a perfectly straight line). This slight alteration caused the pins (the squares in the middle) to touch the edges of the holes. Because they are alternating, it causes a "brace" to hold the header in place. 0.005 has proven to be the perfect amount of "off-center" position when using our standard breakaway headers. Although looks a little odd when you look at the bare footprint, once you have a header in there, the alteration is very hard to notice. Also, if you push a header all the way into place, it is covered up entirely on the bottom side. This idea of altering the position of holes to aid alignment will be further integrated into the Sparkfun Library for other footprints. It can help hold any component with 3 or more connection pins.
JP6 = SparkFun-Connectors:M02: Header 2 Standard 2-pin 0.1" header. Use with straight break away headers (SKU : PRT-00116), right angle break away headers (PRT-00553), swiss pins (PRT-00743), machine pins (PRT-00117), and female headers (PRT-00115). Molex polarized connector foot print use with SKU : PRT-08233 with associated crimp pins and housings.
JP12 = SparkFun-Connectors:M05X2: Header 5x2 Standard 10-pin dual row 0.1" header. Commonly used with AVR-ISP. Use with Spark Fun Electronics SKU: PRT-00778
K1-K4 = relay:ZF112: RELAY 1 x switch; OC_FARNELL: unknown; OC_NEWARK: unknown
L1 L3-L5 = SparkFun-Passives:INDUCTOR: Inductors Basic Inductor/Choke - 0603 and 1206. Footprints are not proven and vary greatly between part numbers.
LED1-LED13 = SparkFun-LED:LED: LEDs Standard schematic elements and footprints for 5mm, 3mm, 1206, and 0603 sized LEDs. 5mm - Spark Fun Electronics SKU : COM-00529 (and others)
R1 = varistor:VARISTOR: VARISTOR
R2 R3 R7-R9 R31-R44 R48 = SparkFun-Passives:RESISTOR: Resistor Basic schematic elements and footprints for 0603, 1206, and PTH resistors.
R4-R6 R10-R29 R45-R47 = SparkFun-Resistors:RESISTOR: Resistor Basic schematic elements and footprints for 0603, 1206, and PTH resistors.
R30 = SparkFun-Electromechanical:TRIMPOT: Various small potentiometers for "set-and-forget" applications
S1-S5 = SparkFun-Electromechanical:TAC_SWITCH: Momentary Switch Button commonly used for reset or general input. Spark Fun Electronics SKU : COM-00097 SMT- SWCH-08247
T1-T4 = SparkFun-DiscreteSemi:MOSFET-NCHANNEL: Common NMOSFET Parts MFG P/N Store ID Prod ID FDD8780 TRANS-09984 SI7820DN TRANS-11055 FDS6630A IC-08089 2N7002PW TRANS-11151 FQP30N06L COM-10213 TRANS-10060 BSS123LT1G TRANS-08345 BSS138 TRANS-00830 BS170 2N7000; PROD_ID: TRANS-08345
U2 = ST Microelctronics_By_element14_Batch_1:STM32F103CBT6: Medium-density performance line ARM-based 32-bit MCU; MPN: STM32F103CBT6; OC_FARNELL: 1606327; OC_NEWARK: 11N8296; PACKAGE: QFP-48; SUPPLIER: STMICROELECTRONICS
U3 = SparkFun-PowerIC:MC34063: Jellybean switching supply controller
U4 = ST Microelctronics_By_element14_Batch_1:ST232CDR: 5 V powered multi-channel RS-232 drivers and receivers; MPN: ST232CDR; OC_FARNELL: 1564303; OC_NEWARK: 89K0993; PACKAGE: SOIC-16; SUPPLIER: STMICROELECTRONICS
U5 = Spansion_By_element14_Batch_1:S25FL016K0XMFI011: 16-Mbit CMOS 3.0 Volt Flash Memory; MPN: S25FL016K0XMFI011; OC_FARNELL: 1861628; OC_NEWARK: 27T2971; PACKAGE: SOIC-8; SUPPLIER: SPANSION
U6 = SparkFun-Displays:LCD-16X2: Standard text-only 16x2 parallel input LCD
U$1 U$3 = microchip-encx24j600:ENC424J600: MICROCHIP ENC424J600 Stand-Alone 10/100 Ethernet Controller with SPI or Parallel Interface
U$2 U$6-U$13 = SparkFun-Connectors:1X02_TERMB_RA
U$4 = nxp_60:NC7SP157
U$5 = STM32F030K6T6:STM32F030K6T6
U$14-U$17 = SparkFun-Connectors:1X03_TERMB_RA
U$18 = VistelV3:TPS56120X
X1 = SparkFun-Connectors:DB9: DB9 Connector Standard DB9 (D-Sub 9) serial connector. Can be used for CAN bus as well as RS485 and RS232. Footprint production proven. Spark Fun Electronics SKU : PRT-00429
Y1 = crystal:MC-306: kHz RANGE CRYSTAL UNIT SMD Source: MC-306_405_406_E07X.PDF Homepage <http://www.epsontoyocom.co.jp>; MPN: MC-306 60.0KHZ 100PPM ,12.5PF; OC_FARNELL: 1278040; OC_NEWARK: 31M5576
Y2-Y4 = SparkFun-FreqCtrl:CRYSTAL: Various standard crystals. Proven footprints. Spark Fun Electronics SKU : COM-00534

## Board
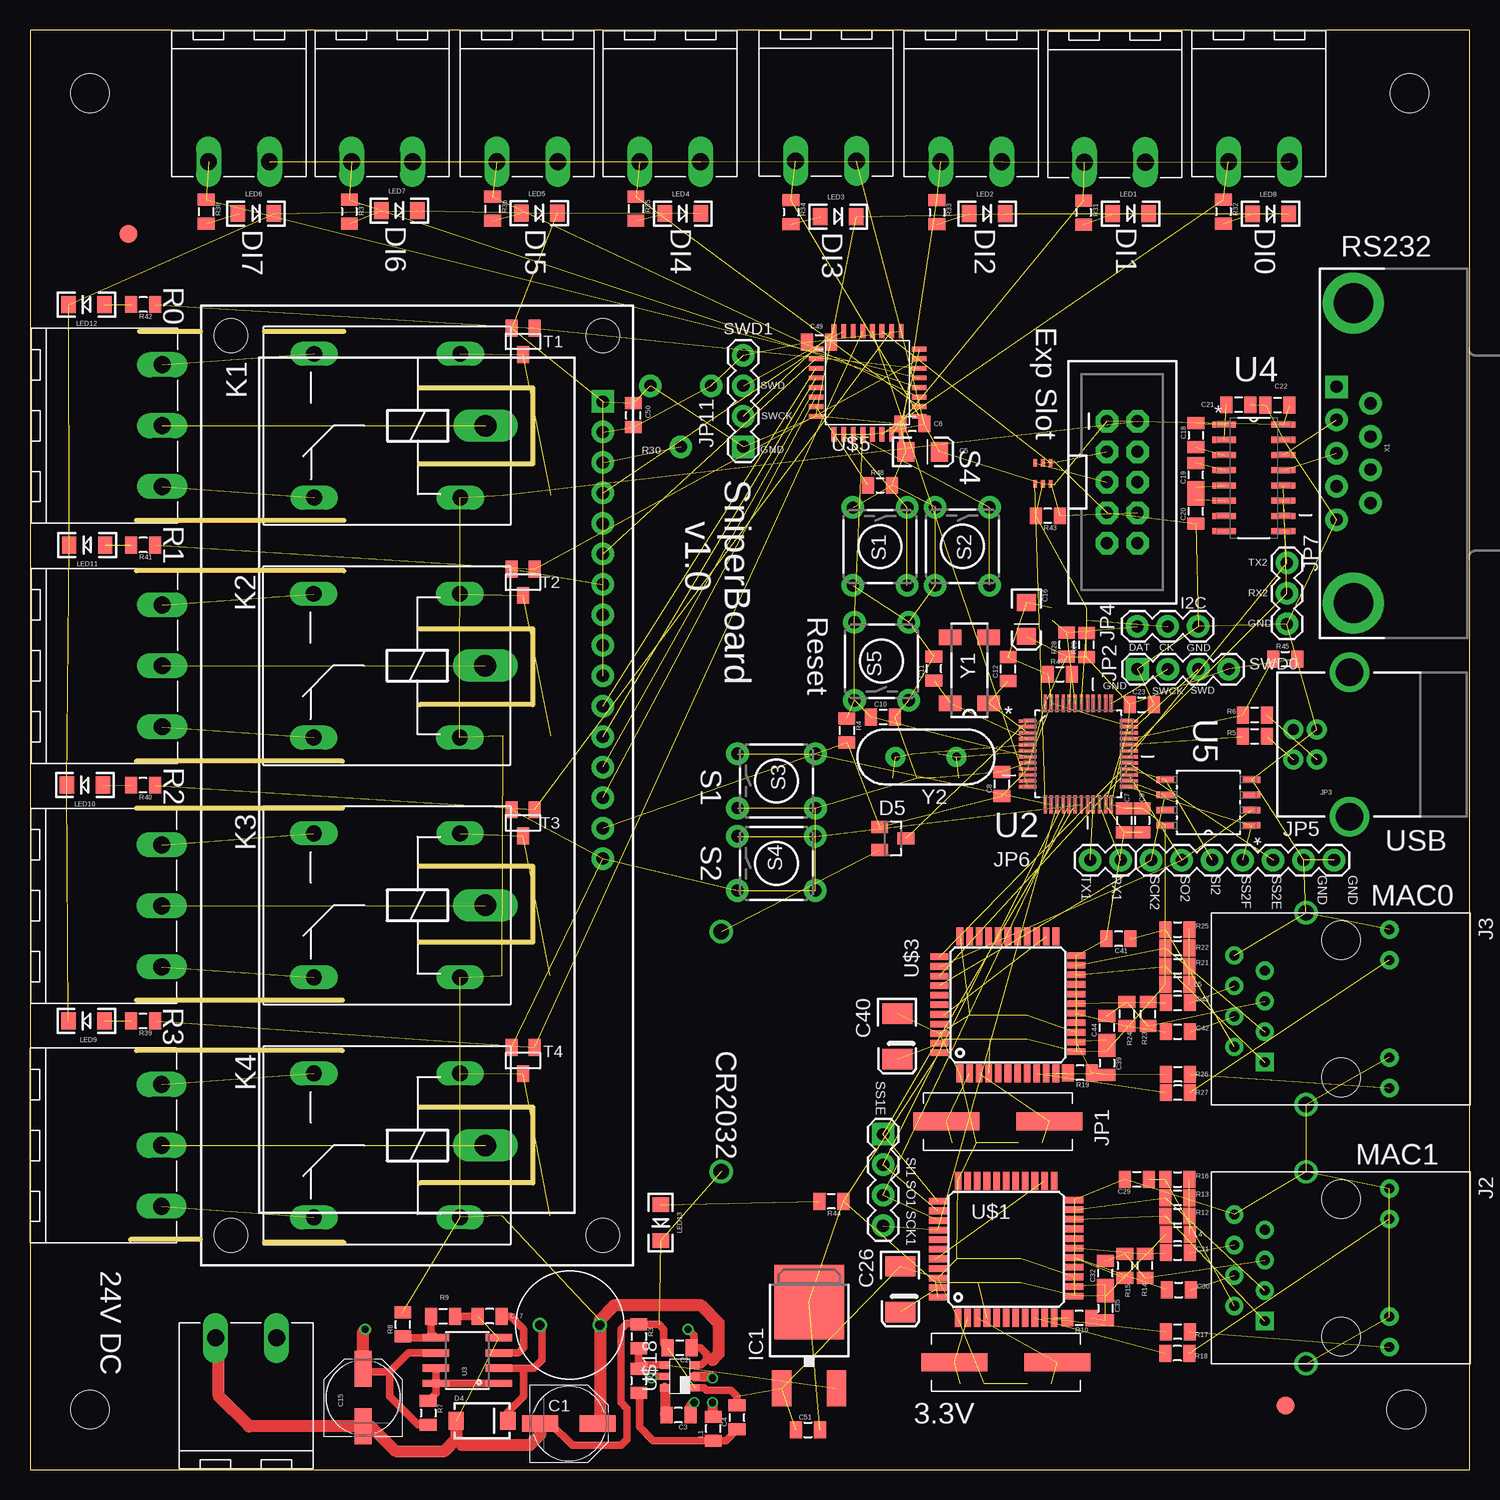
[diagram p5: board, top side]
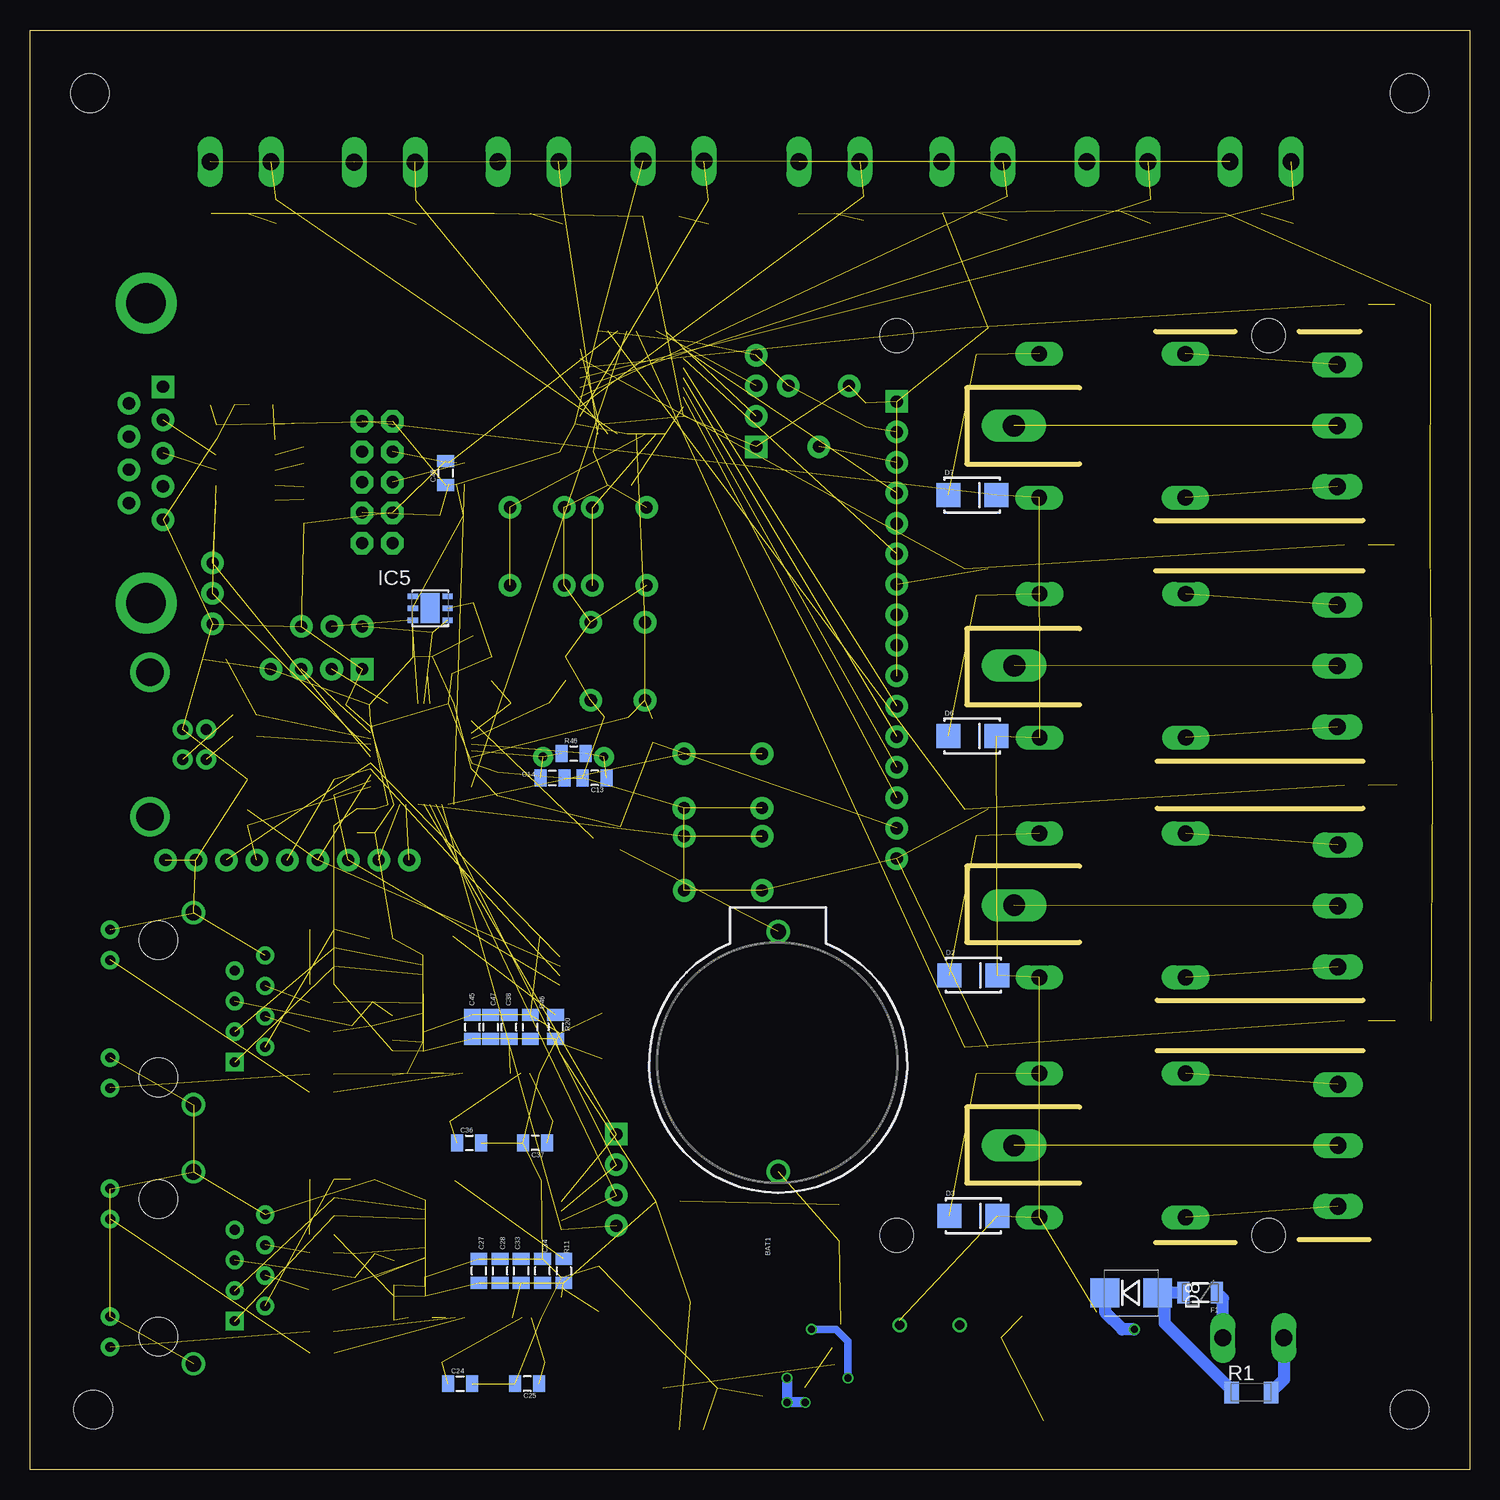
[diagram p6: board, bottom side, seen from below]

Size 120 x 120 mm. Coordinates in mm from the lower left corner, seen from the top.
Outline: 0,0 120,0 120,120 0,120 0,0
Copper layers (1*16): Top 0.035mm / dielectric 1.6mm / Bottom 0.035mm
Design rules "Elecrow_2-layer_PCB_eagle_rule *": minimum track width 8mil, minimum drill 12mil, track to track 8mil, track to pad 8mil, pad to pad 8mil, via to via 8mil, smd to smd 8mil, copper to edge 20mil, drill to drill 10mil, minimum pad ring 6mil, minimum via ring 6mil, stop-mask expansion 0mil, vias tented up to drill 100mil, thermal gap 10mil
Holes 3.2 mm at 5,114.73 114.99,114.73 114.73,5 5,5
Milling: 22 lines

### Footprints (pad centres in the part's own frame; a part is rotated, then mirrored left to right if it is on the bottom)
BATTCOM_20MM_PTH = drill 1.3: 1 20,0; 2 0,0
PANASONIC_D = smd 3 x 1.4: + 2.4,0; - -2.4,0
0805 = smd 1 x 1.4: 1 -1,0; 2 1,0
EIA3216 = smd 1.4 x 1.6: A 1.4,0; C -1.4,0
EIA3528-KIT = smd 1.7 x 2.5: A 1.9,0; C -1.9,0
SMA-DIODE_ALT = smd 2 x 2: A -2,0; C 2,0
SMA-DIODE = smd 1.27 x 1.47: A -2.15,0; C 2.15,0
SOT23 = smd 1 x 1.4: 1 -0.95,-1.1; 2 0.95,-1.1; 3 0,1.1
SMB-DIODE = smd 2.4 x 2.4: A 2.2,0; C -2.2,0
PTC-1206 = smd 1 x 1.8: 1 -1.4,0; 2 1.4,0
FIDUCIAL-1.5X3 = smd 1.5 x 1.5: 1 0,0
DPACK = smd 1.6 x 3: 1 -2.28,-4.8; 3 2.28,-4.8 | smd 5.8 x 6.2: 4 0,2.38
DFN6-3X3 = smd 0.85 x 0.45: 1 -1.45,1; 2 -1.45,0; 3 -1.45,-1; 4 1.45,-1; 5 1.45,0; 6 1.45,1 | smd 1.6 x 2.5: EXP 0,0
RJ45-ABRACON-111008B = drill 0.813 pad 1.524 square: 1 -6.35,-4.445 | drill 0.813 pad 1.524: 2 -8.89,-3.175; 3 -6.35,-1.905; 4 -8.89,-0.635; 5 -6.35,0.635; 6 -8.89,1.905; 7 -6.35,3.175; 8 -8.89,4.445; 9 4.039,-6.604; 10 4.039,-4.064; 11 4.039,4.064; 12 4.039,6.604 | drill 1.3 pad 1.778: SHIELD0 -2.921,8.001; SHIELD1 -2.921,-8.001 | hole 3.2: 0,-5.715; 0,5.715
1X04 = drill 1.016 pad 1.88 square: 1 0,0 | drill 1.016 pad 1.88: 2 2.54,0; 3 5.08,0; 4 7.62,0
USB-B-PTH = drill 0.914 pad 1.676: D+ 0,1.25; D- 1.981,1.25; GND 0,-1.25; VBUS 1.981,-1.25 | drill 2.286: S1 -2.718,-6.02; S2 -2.718,6.02
1X03 = drill 1.016 pad 1.88: 1 0,0; 2 2.54,0; 3 5.08,0
1X07 = drill 1.016 pad 1.88: 1 0,0; 2 2.54,0; 3 5.08,0; 4 7.62,0; 5 10.16,0; 6 12.7,0; 7 15.24,0
1X02 = drill 1.016 pad 1.88: 1 0,0; 2 2.54,0
2X5-SHROUDED = drill 1.016 pad 1.88 octagon: 1 -1.27,5.08; 2 1.27,5.08; 3 -1.27,2.54; 4 1.27,2.54; 5 -1.27,0; 6 1.27,0; 7 -1.27,-2.54; 8 1.27,-2.54; 9 -1.27,-5.08; 10 1.27,-5.08
ZF112 = drill 1.321 long: 1 -6.096,5.994; 2 -6.096,-5.994; O 6.096,5.994; S 6.096,-5.994 | drill 1.803 long: P -8.204,0
RLB914-IND = drill 0.8: P$1 -2.5,0; P$2 2.5,0
LED-1206 = smd 1.2 x 1.4: A -1.5,0; C 1.5,0
CT/CN1206 = smd 1.2 x 1.8: 1 -1.65,0; 2 1.65,0
TRIM_POT_PTH = drill 1 pad 1.88: 1 -2.54,-2.54; 2 0,2.54; 3 2.54,-2.54
TACTILE-PTH = drill 1.016 pad 1.88: 1 -3.251,2.261; 2 3.251,2.261; 3 -3.251,-2.261; 4 3.251,-2.261
QFP50P900X900X160-48N = smd 1.473 x 0.279: 1 -4.216,2.743; 2 -4.216,2.261; 3 -4.216,1.753; 4 -4.216,1.245; 5 -4.216,0.762; 6 -4.216,0.254; 7 -4.216,-0.254; 8 -4.216,-0.762; 9 -4.216,-1.245; 10 -4.216,-1.753; 11 -4.216,-2.261; 12 -4.216,-2.743; 25 4.216,-2.743; 26 4.216,-2.261; 27 4.216,-1.753; 28 4.216,-1.245; 29 4.216,-0.762; 30 4.216,-0.254; 31 4.216,0.254; 32 4.216,0.762; 33 4.216,1.245; 34 4.216,1.753; 35 4.216,2.261; 36 4.216,2.743 | smd 0.279 x 1.473: 13 -2.743,-4.216; 14 -2.261,-4.216; 15 -1.753,-4.216; 16 -1.245,-4.216; 17 -0.762,-4.216; 18 -0.254,-4.216; 19 0.254,-4.216; 20 0.762,-4.216; 21 1.245,-4.216; 22 1.753,-4.216; 23 2.261,-4.216; 24 2.743,-4.216; 37 2.743,4.216; 38 2.261,4.216; 39 1.753,4.216; 40 1.245,4.216; 41 0.762,4.216; 42 0.254,4.216; 43 -0.254,4.216; 44 -0.762,4.216; 45 -1.245,4.216; 46 -1.753,4.216; 47 -2.261,4.216; 48 -2.743,4.216
SO08 = smd 0.61 x 2.21: 1 -1.905,-2.616; 2 -0.635,-2.616; 3 0.635,-2.616; 4 1.905,-2.616; 5 1.905,2.616; 6 0.635,2.616; 7 -0.635,2.616; 8 -1.905,2.616
SOIC127P600X175-16N = smd 1.981 x 0.508: 1 -2.464,4.445; 2 -2.464,3.175; 3 -2.464,1.905; 4 -2.464,0.635; 5 -2.464,-0.635; 6 -2.464,-1.905; 7 -2.464,-3.175; 8 -2.464,-4.445; 9 2.464,-4.445; 10 2.464,-3.175; 11 2.464,-1.905; 12 2.464,-0.635; 13 2.464,0.635; 14 2.464,1.905; 15 2.464,3.175; 16 2.464,4.445
SOIC127P800X215-8N = smd 1.473 x 0.533: 1 -3.607,1.905; 2 -3.607,0.635; 3 -3.607,-0.635; 4 -3.607,-1.905; 5 3.607,-1.905; 6 3.607,-0.635; 7 3.607,0.635; 8 3.607,1.905
LCD-16X2 = drill 1.016 pad 1.88 square: 1 -32,15.5 | drill 1.016 pad 1.88: 2 -29.46,15.5; 3 -26.92,15.5; 4 -24.38,15.5; 5 -21.84,15.5; 6 -19.3,15.5; 7 -16.76,15.5; 8 -14.22,15.5; 9 -11.68,15.5; 10 -9.14,15.5; 11 -6.6,15.5; 12 -4.06,15.5; 13 -1.52,15.5; 14 1.02,15.5; 15 3.56,15.5; 16 6.1,15.5 | hole 2.8: -37.5,15.5; -37.5,-15.5; 37.5,15.5; 37.5,-15.5
TQFP-44 = smd 1.5 x 0.55: 1 -5.7,4; 2 -5.7,3.2; 3 -5.7,2.4; 4 -5.7,1.6; 5 -5.7,0.8; 6 -5.7,0; 7 -5.7,-0.8; 8 -5.7,-1.6; 9 -5.7,-2.4; 10 -5.7,-3.2; 11 -5.7,-4; 23 5.7,-4; 24 5.7,-3.2; 25 5.7,-2.4; 26 5.7,-1.6; 27 5.7,-0.8; 28 5.7,0; 29 5.7,0.8; 30 5.7,1.6; 31 5.7,2.4; 32 5.7,3.2; 33 5.7,4 | smd 0.55 x 1.5: 12 -3.9,-5.7; 13 -3.1,-5.7; 14 -2.3,-5.7; 15 -1.5,-5.7; 16 -0.7,-5.7; 17 0.1,-5.7; 18 0.9,-5.7; 19 1.7,-5.7; 20 2.5,-5.7; 21 3.3,-5.7; 22 4.1,-5.7; 34 4,5.7; 35 3.2,5.7; 36 2.4,5.7; 37 1.6,5.7; 38 0.8,5.7; 39 0,5.7; 40 -0.8,5.7; 41 -1.6,5.7; 42 -2.4,5.7; 43 -3.2,5.7; 44 -4,5.7
1X02_TERMB_RA = drill 1.4 long: P$1 0,2.54; P$2 0,-2.54
SC70-6 = smd 0.61 x 0.305: P$1 -0.85,0; P$2 0.9,0; P$3 0.9,-0.65; P$4 -0.85,-0.65; P$5 -0.85,-1.3; P$6 0.9,-1.3
LQFP32-7X7 = smd 1.2 x 0.4: 1 -4.3,2.8; 2 -4.3,2; 3 -4.3,1.2; 4 -4.3,0.4; 5 -4.3,-0.4; 6 -4.3,-1.2; 7 -4.3,-2; 8 -4.3,-2.8; 17 4.3,-2.8; 18 4.3,-2; 19 4.3,-1.2; 20 4.3,-0.4; 21 4.3,0.4; 22 4.3,1.2; 23 4.3,2; 24 4.3,2.8 | smd 0.4 x 1.2: 9 -2.8,-4.3; 10 -2,-4.3; 11 -1.2,-4.3; 12 -0.4,-4.3; 13 0.4,-4.3; 14 1.2,-4.3; 15 2,-4.3; 16 2.8,-4.3; 25 2.8,4.3; 26 2,4.3; 27 1.2,4.3; 28 0.4,4.3; 29 -0.4,4.3; 30 -1.2,4.3; 31 -2,4.3; 32 -2.8,4.3
1X03_TERMB_RA = drill 1.4 long: P$1 0,5.08; P$2 0,0; P$3 0,-5.08
TSOT23-6_DDC = smd 0.6 x 0.8: 1 -0.95,-1.25; 2 0,-1.25; 3 0.95,-1.25; 4 0.95,1.25; 5 0,1.25; 6 -0.95,1.25
DB9 = drill 1.016 pad 1.88 square: 1 -5.54,-1.42 | drill 1.016 pad 1.88: 2 -2.77,-1.42; 3 0,-1.42; 4 2.77,-1.42; 5 5.54,-1.42; 6 -4.15,1.42; 7 -1.38,1.42; 8 1.38,1.42; 9 4.15,1.42 | drill 3.302 pad 5.08: G1 -12.5,0; G2 12.5,0
MC-306 = smd 1.3 x 1.9: 1 -2.75,-1.6; 2 2.75,-1.6; 3 2.75,1.6; 4 -2.75,1.6
HC49US = drill 0.7 pad 1.651: 1 -2.54,0; 2 2.54,0
CRYSTAL-SMD-10.5X4.8-2PIN = smd 5.5 x 1.5: P$1 -4.3,0; P$2 4.3,0

### Placement (x,y rotation side)
BAT1  57.63,24.84 90 bottom
C1  44.93,3.83 0 top
C2  54.16,10.14 180 top
C3  54.05,4.54 180 top
C4  58.94,4.33 90 top
C5  74.42,84.84 0 top
C6  73.55,87.16 180 top
C7  91.21,54.1 270 top
C8  81.03,57.15 90 top
C9  92.71,54.1 270 top
C10  71.12,62.74 0 top
C11  75.36,66.77 90 top
C12  81.53,66.74 90 top
C13  72.93,57.65 180 bottom
C14  76.45,57.66 0 bottom
C15  27.77,5.99 90 top
C16  83.06,70.87 270 top
C17  38.32,12.78 180 top
C18  97.19,86.22 270 top
C19  97.19,82.92 90 top
C20  97.19,79.87 90 top
C21  100.74,88.76 180 top
C22  104,88.74 0 top
C23  92.67,63.77 0 top
C24  84.14,7.16 0 bottom
C25  78.55,7.16 180 bottom
C26  72.55,15.03 270 top
C27  82.59,16.56 90 bottom
C28  80.81,16.56 90 bottom
C29  92.27,24.18 180 top
C30  95.75,14.97 0 top
C31  95.67,18.08 0 top
C32  89.65,16.38 90 top
C33  79.06,16.56 90 bottom
C34  77.28,16.56 90 bottom
C35  89.65,13.43 270 top
C36  83.38,27.23 0 bottom
C37  77.89,27.23 180 bottom
C38  80.07,36.88 90 bottom
C39  89.78,33.88 270 top
C40  72.3,36.12 270 top
C41  90.74,44.24 180 top
C42  95.67,36.5 0 top
C43  95.67,38.91 0 top
C44  89.78,36.83 90 top
C45  83.12,36.88 90 bottom
C46  78.3,36.88 90 bottom
C47  81.6,36.88 90 bottom
C48  85.34,83.06 90 bottom
C49  65.79,93.98 0 top
C50  50.29,87.88 90 top
C51  64.85,3.3 0 top
D2  41.35,41.21 0 bottom
D3  41.35,21.14 0 bottom
D4  37.68,4.06 0 top
D5  71.93,52.6 270 top
D6  41.45,61.16 0 bottom
D7  41.45,81.22 0 bottom
D8  28.19,14.73 0 bottom
F1  22.44,14.74 180 bottom
FID1  104.65,5.33 0 top
FID2  8.22,103 0 top
IC1  64.95,11.58 0 top
IC5  86.64,71.8 180 bottom
J2  109.28,16.81 0 top
J3  109.28,38.4 0 top
JP1  71.12,27.94 270 top
JP2  92.31,66.72 0 top
JP3  107.28,60.44 180 top
JP4  97.38,70.28 180 top
JP5  108.71,50.8 180 top
JP6  90.93,50.8 180 top
JP7  104.78,70.48 90 top
JP11  59.47,85.26 90 top
JP12  91.05,82.31 0 top
K1  29.77,87.01 180 top
K2  29.74,67 180 top
K3  29.76,47.03 180 top
K4  29.76,27.01 180 top
L1  56.96,3.41 90 top
L3  45.01,12.03 0 top
L4  95.67,19.61 180 top
L5  95.67,40.43 180 top
LED1  91.76,104.69 0 top
LED2  79.8,104.69 0 top
LED3  67.38,104.45 0 top
LED4  54.42,104.7 0 top
LED5  42.45,104.72 0 top
LED6  18.85,104.7 0 top
LED7  30.78,104.94 0 top
LED8  103.41,104.67 0 top
LED9  4.7,37.4 180 top
LED10  4.57,57.05 180 top
LED11  4.77,77.07 180 top
LED12  4.71,97.11 180 top
LED13  52.58,20.57 270 top
R1  18.19,6.43 0 bottom
R2  50.74,7.4 270 top
R3  50.75,11.08 270 top
R4  68.09,61.61 270 top
R5  102.09,61.12 0 top
R6  102.08,62.9 0 top
R7  33.2,4.71 270 top
R8  31.08,12.09 90 top
R9  34.43,12.78 0 top
R10  87.47,12.63 180 top
R11  75.5,16.56 270 bottom
R12  95.67,21.13 0 top
R13  95.67,22.65 0 top
R14  92.95,16.99 90 top
R15  91.27,16.99 270 top
R16  95.67,24.18 0 top
R17  95.67,11.48 180 top
R18  95.64,9.7 180 top
R19  87.54,33.07 180 top
R20  76.19,36.91 270 bottom
R21  95.67,41.96 0 top
R22  95.67,43.48 0 top
R23  93.2,37.97 90 top
R24  91.43,37.97 270 top
R25  95.67,45.01 0 top
R26  95.69,32.94 180 top
R27  95.69,31.42 180 top
R28  86.42,68.76 90 top
R29  88.08,68.75 90 top
R30  54.25,87.8 180 top
R31  87.83,104.79 270 top
R32  99.49,104.85 270 top
R33  75.61,104.8 270 top
R34  63.44,104.82 270 top
R35  50.51,105.11 270 top
R36  38.56,105.09 270 top
R37  26.62,104.86 270 top
R38  14.68,104.85 270 top
R39  9.42,37.39 180 top
R40  9.42,57.04 180 top
R41  9.43,77.07 180 top
R42  9.43,97.12 180 top
R43  84.84,79.5 180 top
R44  66.8,22.35 180 top
R45  104.65,67.56 0 top
R46  74.68,59.69 0 bottom
R47  85.85,66.29 0 top
R48  70.87,82.04 0 top
S1  70.86,76.95 270 top
S2  77.72,76.96 270 top
S3  62.23,57.4 0 top
S4  62.22,50.53 0 top
S5  70.99,67.38 90 top
T1  41.1,94.04 180 top
T2  41.1,73.97 180 top
T3  41.1,53.91 180 top
T4  41.1,34.09 180 top
U2  87.39,59.66 0 top
U3  36.45,9.09 90 top
U4  102.01,82.66 0 top
U5  98.23,55.61 180 top
U6  32.25,57.03 270 top
U$1  81.37,18.36 90 top
U$2  18.01,10.97 270 top
U$3  81.52,38.73 90 top
U$4  85.09,83.06 270 top
U$5  69.83,90.6 90 top
U$6  102.45,109.03 90 top
U$7  90.43,108.98 90 top
U$8  66.36,109.08 90 top
U$9  41.45,109.03 90 top
U$10  17.42,109.03 90 top
U$11  29.35,109.03 90 top
U$12  53.37,109.03 90 top
U$13  78.46,109.03 90 top
U$14  11.02,87.02 180 top
U$15  11.02,66.99 180 top
U$16  10.98,46.99 180 top
U$17  10.96,27.02 180 top
U$18  54.17,7.76 90 top
X1  110.33,84.72 270 top
Y1  78.31,66.63 90 top
Y2  74.69,59.4 180 top
Y3  81.34,8.94 180 top
Y4  80.68,29 180 top

### Tracks (layer width: path | path; a pad name or v marks a point on that pad's centre or on a via)
3.3V  (68 unrouted)
232_RX  (1 unrouted)
232_TX  (1 unrouted)
+5V
  Top 0.61: C4.1 58.02,2.41 L1.1 51.94,2.41 50.8,3.56 50.8,6.34 R2.2
+12V  (via drill 0.6)  (10 unrouted)
  Top 0.61: 56.39,9.14 56.39,9.65 55.9,10.14 C2.1 55.37,10.34 55.37,11.18 v54.86,11.68 | U$18.3 55.96,8.71 56.13,8.89 56.39,9.14 | U$18.5 51.96,7.76 v51.82,7.62 | 56.9,9.14 56.39,9.14
  Top 1.016: C1.+ 47.51,4.01 L3.P$2 47.51,12.46 48.77,13.72 55.88,13.72 57.4,12.19 57.4,9.65 56.9,9.14
  Bottom 0.61: v51.82,7.62 51.82,10.67 52.83,11.68 v54.86,11.68
BOOT0  (1 unrouted)
DAISY_MUX  (1 unrouted)
DAISY_RX0  (1 unrouted)
DAISY_RX1  (1 unrouted)
DAISY_RX2  (2 unrouted)
DI_0  (2 unrouted)
DI_1  (2 unrouted)
DI_2  (2 unrouted)
DI_3  (2 unrouted)
DI_4  (2 unrouted)
DI_5  (2 unrouted)
DI_6  (2 unrouted)
DI_7  (2 unrouted)
DO_0  (2 unrouted)
DO_1  (2 unrouted)
DO_2  (2 unrouted)
DO_3  (2 unrouted)
G_RESET  (5 unrouted)
GND  (126 unrouted)
  Top 0.61: R9.2 C17.2 | U$18.1 56.18,6.81 56.39,6.6 58.42,6.6 58.93,6.1 58.93,5.34 C4.2 | C2.2 52.83,10.47 52.83,11.68 52.43,12.08 R3.1 50.64,12.19 49.78,12.19 49.28,11.68 49.28,5.59 49.78,5.08 49.78,2.54 49.28,2.03 45.21,2.03 43.41,3.83 C1.-
  Top 1.016: U$2.P$2 15.75,10.69 15.75,6.1 18.25,3.59 C15.- 28.41,3.59 30.48,1.52 34.54,1.52 35.53,2.51 | D4.A 35.53,2.51 | C1.- 42.53,2.9 41.66,2.03 36,2.03 35.53,2.51
  Bottom 1.016: U$2.P$2 15.47,7.5 R1.2
I2C1_SCL  (3 unrouted)
I2C1_SDA  (3 unrouted)
LA1  (1 unrouted)
LA2  (1 unrouted)
LB1  (1 unrouted)
LB2  (1 unrouted)
LCD_D4  (1 unrouted)
LCD_D5  (1 unrouted)
LCD_D6  (1 unrouted)
LCD_D7  (1 unrouted)
LCD_E  (1 unrouted)
LCD_RS  (1 unrouted)
N$1  (1 unrouted)
N$3  (1 unrouted)
N$4
  Bottom 1.016: U$2.P$1 20.55,14.25 F1.1
N$5
  Bottom 1.016: F1.2 25.4,14.74 | 25.4,14.74 D8.A | R1.1 19.84,6.63 25.4,12.19 25.4,14.74
N$6  (via drill 0.6)
  Top 0.813: U$18.2 56.75,7.76 v56.9,7.62 | v56.9,5.59 56.9,4.48 L1.2 | C3.1 55.05,5.27 v55.37,5.59
  Bottom 0.813: v56.9,7.62 v56.9,5.59 v55.37,5.59
N$7  (3 unrouted)
N$8  (1 unrouted)
N$9  (1 unrouted)
N$10  (1 unrouted)
N$11  (1 unrouted)
N$12  (1 unrouted)
N$13  (1 unrouted)
N$14  (2 unrouted)
N$15  (2 unrouted)
N$16  (3 unrouted)
N$17  (1 unrouted)
N$19
  Top 0.813: U$18.6 52.92,4.67 C3.2
N$20  (1 unrouted)
  Top 0.61: R3.2 R2.1 51.06,8.71 U$18.4
N$21  (1 unrouted)
N$22
  Top 0.61: U3.3 40.71,9.72 41.15,10.16 41.15,11.68 40.05,12.78 C17.1
N$24
  Top 0.61: U3.2 41.15,8.45 | 41.15,8.45 41.98,8.45 42.67,9.14 42.67,11.87 L3.P$1 | D4.C 39.83,4.77 41.15,6.1 41.15,8.45
N$25
  Top 0.61: R8.1 31.18,10.99 U3.5 33.43,11.4 R9.1
N$26  (1 unrouted)
N$27  (1 unrouted)
N$28  (1 unrouted)
N$29  (1 unrouted)
N$30  (1 unrouted)
N$31  (1 unrouted)
N$33  (2 unrouted)
N$34  (1 unrouted)
N$35  (2 unrouted)
N$36  (2 unrouted)
N$37  (1 unrouted)
N$38  (2 unrouted)
N$39  (1 unrouted)
N$40  (2 unrouted)
N$41  (1 unrouted)
N$42  (1 unrouted)
N$43  (1 unrouted)
N$44  (1 unrouted)
N$45  (3 unrouted)
N$46  (1 unrouted)
N$47  (2 unrouted)
N$48  (2 unrouted)
N$49  (2 unrouted)
N$50  (3 unrouted)
N$51  (1 unrouted)
N$52  (1 unrouted)
N$53  (1 unrouted)
N$54  (1 unrouted)
N$55  (1 unrouted)
N$56  (1 unrouted)
N$57  (1 unrouted)
N$58  (1 unrouted)
N$59  (1 unrouted)
N$60  (1 unrouted)
N$61  (1 unrouted)
N$62  (2 unrouted)
N$63  (2 unrouted)
N$64  (2 unrouted)
N$65  (2 unrouted)
N$66  (1 unrouted)
N$67  (1 unrouted)
N$69  (1 unrouted)
N$70  (1 unrouted)
N$71  (1 unrouted)
N$72  (1 unrouted)
N$73  (1 unrouted)
N$74  (1 unrouted)
N$75  (1 unrouted)
N$77  (2 unrouted)
N$78  (1 unrouted)
N$80  (1 unrouted)
N$82  (1 unrouted)
N$87  (1 unrouted)
RX1+  (1 unrouted)
RX1-  (1 unrouted)
RX1_CT  (3 unrouted)
RX2+  (1 unrouted)
RX2-  (1 unrouted)
RX2_CT  (3 unrouted)
SPI1_MISO  (2 unrouted)
SPI1_MOSI  (2 unrouted)
SPI1_SCK  (2 unrouted)
SPI1_SS1_ETH1  (2 unrouted)
SPI2_MISO  (3 unrouted)
SPI2_MOSI  (3 unrouted)
SPI2_SCK  (3 unrouted)
SPI2_SS1_ETH2  (2 unrouted)
SPI2_SS2_FLASH  (2 unrouted)
SW0  (2 unrouted)
SW1  (2 unrouted)
SW2  (2 unrouted)
SW3  (2 unrouted)
SWDCLK  (1 unrouted)
SWDIO  (1 unrouted)
TX1+  (2 unrouted)
TX1-  (2 unrouted)
TX1_CT  (2 unrouted)
TX2+  (2 unrouted)
TX2-  (2 unrouted)
TX2_CT  (2 unrouted)
UART_RX1  (1 unrouted)
UART_RX2  (2 unrouted)
UART_TX1  (1 unrouted)
UART_TX2  (2 unrouted)
USB_D+  (2 unrouted)
USB_D-  (1 unrouted)
VBAT  (1 unrouted)
VIN  (via drill 0.6)
  Top 0.61: U3.6 31.57,9.72 29.97,8.13 | 29.97,8.13 28.04,8.13 C15.+ | R7.2 32.35,3.71 29.97,6.1 29.97,8.13
  Top 1.016: C15.+ 27.77,11.52 v27.94,11.68
  Bottom 1.016: v27.94,11.68 28.96,11.68 30.39,13.12 D8.C
VIN2
  Top 0.61: U3.7 U3.8 | U3.8 U3.1 | U3.8 33.84,6.35 R7.1

### Text on the board
tPlace: DI6 | DI4 | DI1 | DI0 | DI7 | DI5 | DI3 | DI2 | RS232 | R0 | SWD1 | Exp Slot | SWD | SWCK | GND | S4 | SniperBoard / v1.0 | R1 | TX2 | RX2 | I2C | Reset | GND | DAT | CK | GND | SWD0 | GND | SWCK | SWD | R2 | S1 | USB | S2 | TX1 | RX1 | SCK2 | SO2 | SI2 | SS2F | SS2E | GND | GND | MAC0 | R3 | CR2032 | SS1E | SI1 | MAC1 | SO1 | SCK1 | 24V DC | 3.3V